# EAGLE design STM Board (EAGLE 9.6.1)
DRAWNBY: Joshua Castle; PROJECT: STM Microcontroller; TITLE: Microcontroller Breakout

## Sheet 1 of 6: Battery Reverse Protection and Power Filtering
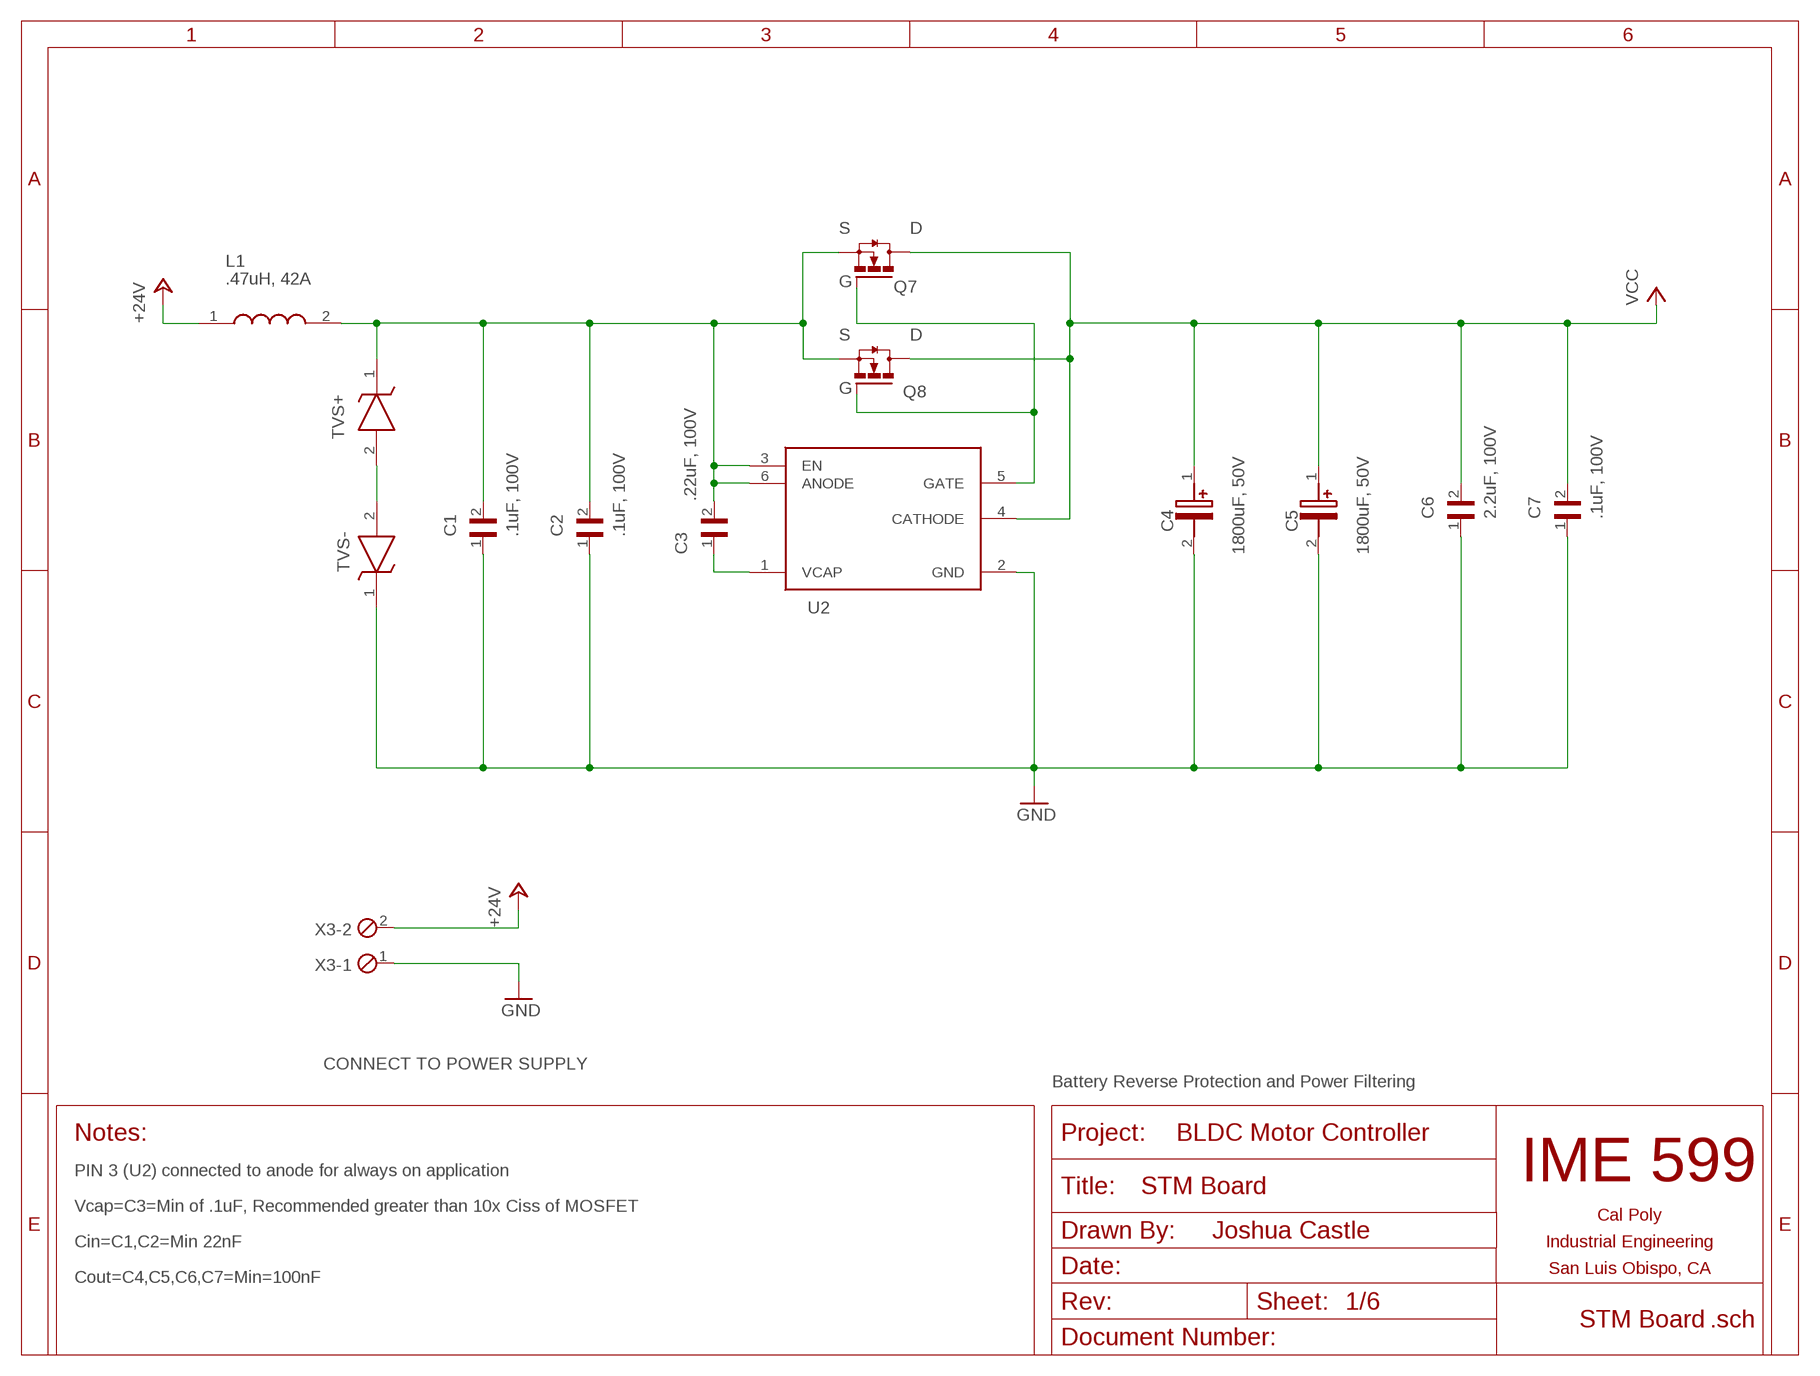
[diagram p0: schematic, sheet 1]
FRAME2 (TITLEBLOCK_LET_L): AUTHOR: Joshua Castle; BOARD_NAME: STM Board; PROJECT_NAME: BLDC Motor Controller

### Parts
C1  .1uF, 100V  CGA4J2X7R1E474K125AA  [CAPC2012X145N]
C2  .1uF, 100V  CGA4J2X7R1E474K125AA  [CAPC2012X145N]
C3  .22uF, 100V  C0805C224K1RECAUTO  [CAPC2012X140N]
C4  1800uF, 50V  EGPA500ELL182MU40S(HORIZONTAL)  [CAPPRD750W80D1475H4150(HORIZONTAL)]
C5  1800uF, 50V  EGPA500ELL182MU40S(HORIZONTAL)  [CAPPRD750W80D1475H4150(HORIZONTAL)]
C6  2.2uF, 100V  C1210X225K1RACAUTO  [CAPC3326X230N]
C7  .1uF, 100V  CGA4J2X7R2A104K125AA  [CAPC2012X145N]
L1  .47uH, 42A  HCM1A1305V2-R47-R  [HCM1A1305V2R47R]
Q7  FDBL86361-F085  [H-PSOF8L-11.68X9.80_1]
Q8  FDBL86361-F085  [H-PSOF8L-11.68X9.80_1]
TVS+  SMBJ58A-Q  [DIOM5436X244N]
TVS-  SMBJ26A-Q  [DIOM5436X244N]
U2  LM74700-Q1MKX-1_NOPB  [SOT95P280X145-6N]
X3  SCREWTERM_2P_254  [2POL254]

### Nets
+24V: L1.1 X3.2
GND: C1.1 C2.1 C4.2(-) C5.2(-) C6.1 C7.1 TVS-.1(K) U2.2(GND) X3.1 ; also sheet 2,3,5,6
N$14: Q7.1(G) Q8.1(G) U2.5(GATE)
N$16: C3.1 U2.1(VCAP)
PN$6: C1.2 C2.2 C3.2 L1.2 Q7.2(S) Q7.3(S) Q7.4(S) Q7.5(S) Q7.6(S) Q7.7(S) Q7.8(S) Q8.2(S) Q8.3(S) Q8.4(S) Q8.5(S) Q8.6(S) Q8.7(S) Q8.8(S) TVS+.1(K) U2.3(EN) U2.6(ANODE)
PN$25: TVS+.2(A) TVS-.2(A)
VCC: C4.1(+) C5.1(+) C6.2 C7.2 Q7.9(D) Q7.10(D) Q7.11(D) Q7.12(D) Q7.13(D) Q8.9(D) Q8.10(D) Q8.11(D) Q8.12(D) Q8.13(D) U2.4(CATHODE) ; also sheet 2,3,4

### Notes on the sheet
- S | D
- G
- S | D
- G
- CONNECT TO POWER SUPPLY
- Battery Reverse Protection and Power Filtering
- PIN 3 (U2) connected to anode for always on application
- Vcap=C3=Min of .1uF, Recommended greater than 10x Ciss of MOSFET
- Cin=C1,C2=Min 22nF
- Cout=C4,C5,C6,C7=Min=100nF

## Sheet 2 of 6: 3-Phase Bridge (Motor Driver Side)
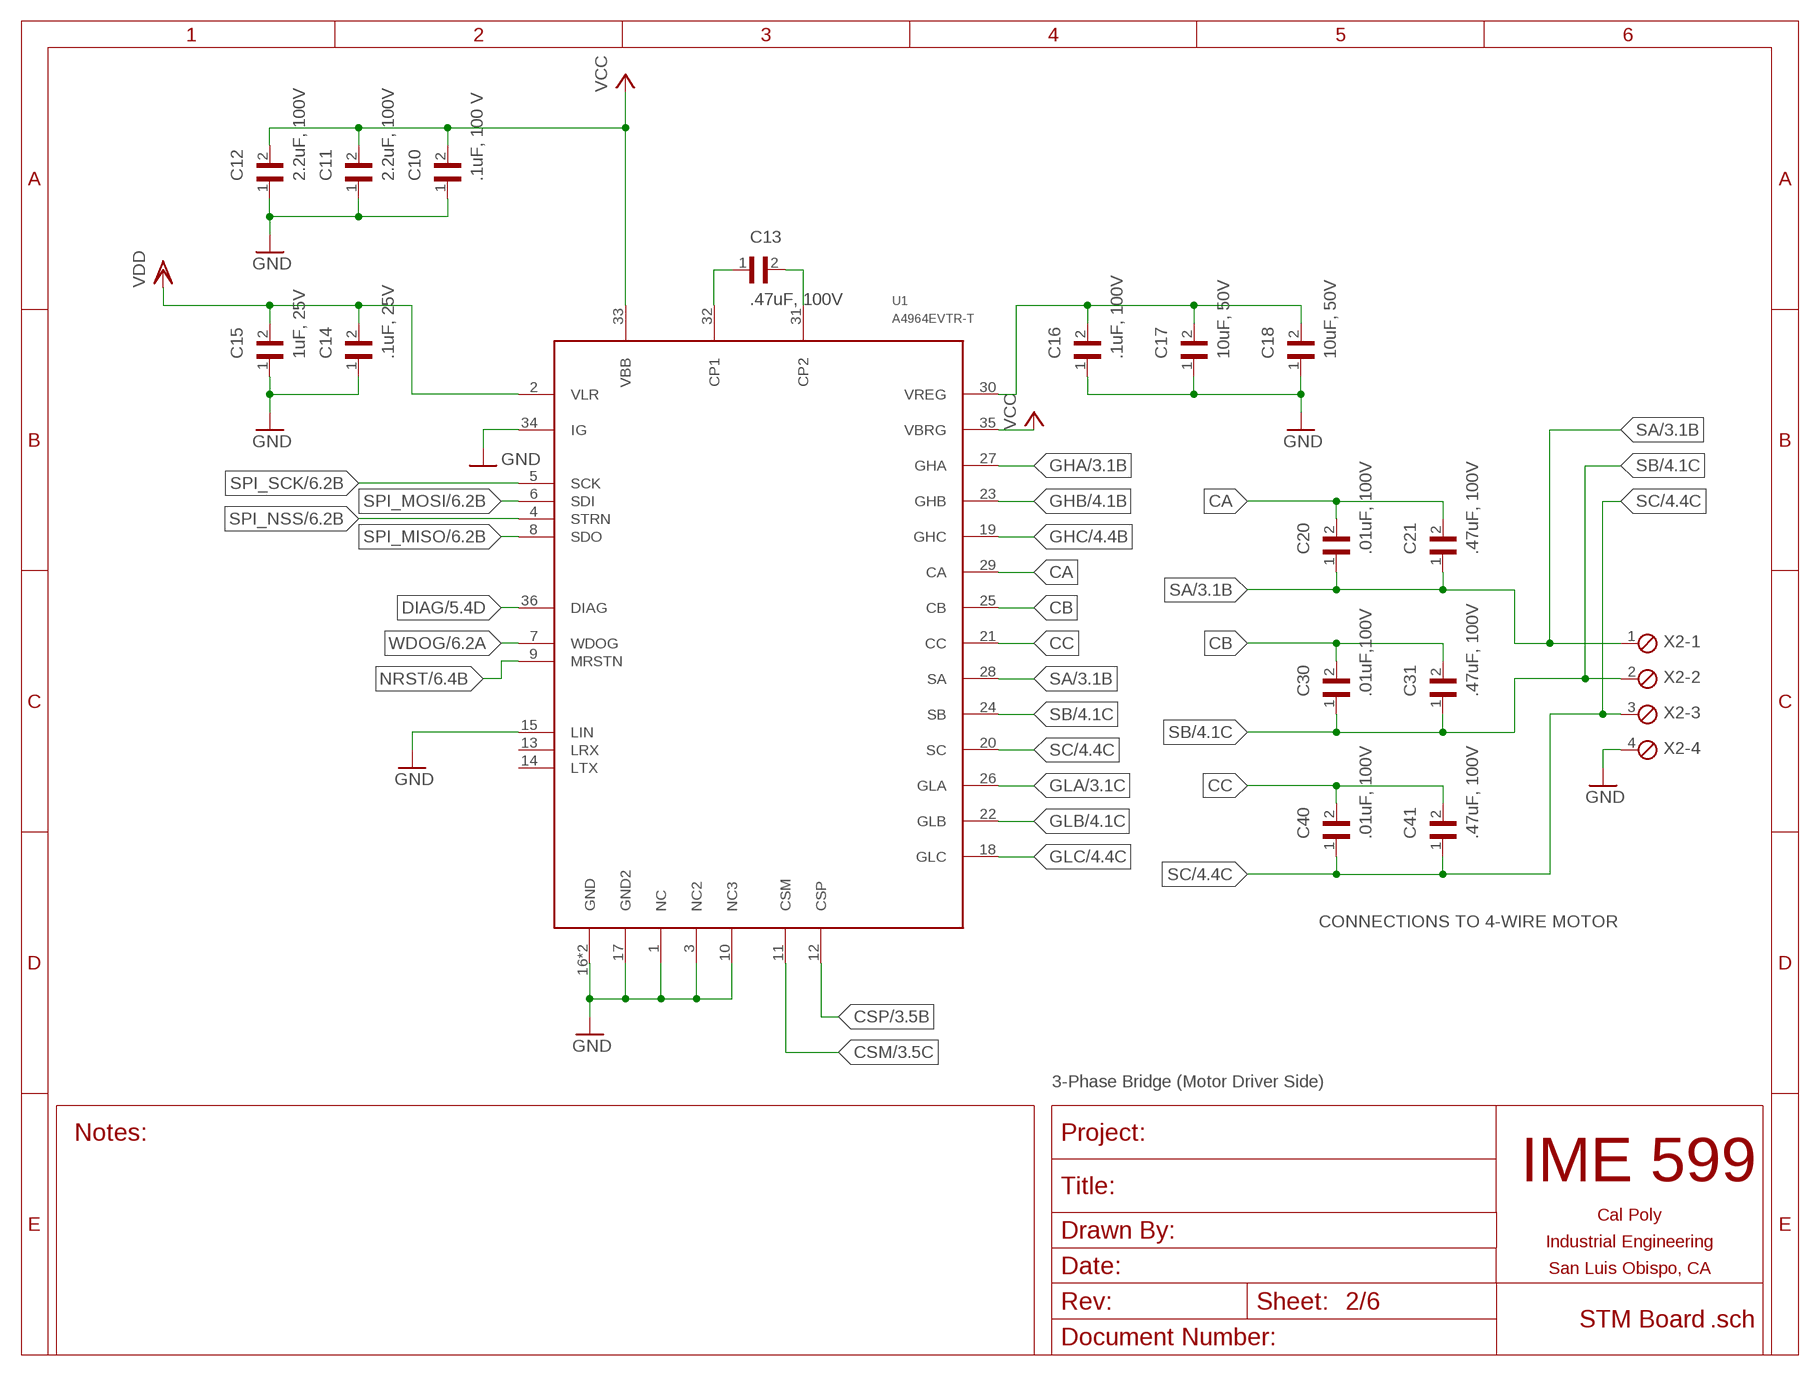
[diagram p1: schematic, sheet 2]

### Parts
C10  .1uF, 100 V  CGA4J2X7R2A104K125AA  [CAPC2012X145N]
C11  2.2uF, 100V  C1210X225K1RACAUTO  [CAPC3326X230N]
C12  2.2uF, 100V  C1210X225K1RACAUTO  [CAPC3326X230N]
C13  .47uF, 100V  08051C474K4T2A  [CAPC2012X140N]
C14  .1uF, 25V  CGA3E2X7R1E104K080AA  [CAPC1608X90N]
C15  1uF, 25V  GCM21BR71H105KA03K  [CAPC2012X140N]
C16  .1uF, 100V  CGA4J2X7R1E474K125AA  [CAPC2012X145N]
C17  10uF, 50V  UMJ325KB7106KMHP  [CAPC3225X280N]
C18  10uF, 50V  UMJ325KB7106KMHP  [CAPC3225X280N]
C20  .01uF, 100V  GCM188R72A103KA37D  [CAPC1608X90N]
C21  .47uF, 100V  08051C474K4T2A  [CAPC2012X140N]
C30  .01uF,100V  GCM188R72A103KA37D  [CAPC1608X90N]
C31  .47uF, 100V  08051C474K4T2A  [CAPC2012X140N]
C40  .01uF, 100V  GCM188R72A103KA37D  [CAPC1608X90N]
C41  .47uF, 100V  08051C474K4T2A  [CAPC2012X140N]
U1  A4964EVTR-T  [A4964EVTR-T]
X2  SCREWTERM_4P_254  [4POL254]

### Nets
CA: C20.2 C21.2 U1.29(CA)
CB: C30.2 C31.2 U1.25(CB)
CC: C40.2 C41.2 U1.21(CC)
CSM: U1.11(CSM) ; also sheet 3
CSP: U1.12(CSP) ; also sheet 3
DIAG: U1.36(DIAG) ; also sheet 5
GHA: U1.27(GHA) ; also sheet 3
GHB: U1.23(GHB) ; also sheet 4
GHC: U1.19(GHC) ; also sheet 4
GLA: U1.26(GLA) ; also sheet 3
GLB: U1.22(GLB) ; also sheet 4
GLC: U1.18(GLC) ; also sheet 4
GND: C10.1 C11.1 C12.1 C14.1 C15.1 C16.1 C17.1 C18.1 U1.1(NC) U1.3(NC2) U1.10(NC3) U1.15(LIN) U1.16(GND) U1.17(GND2) U1.34(IG) U1.37(GND) X2.4 ; also sheet 1,3,5,6
N$2: C13.1 U1.32(CP1)
N$8: C13.2 U1.31(CP2)
NRST: U1.9(MRSTN) ; also sheet 6
SA: C20.1 C21.1 U1.28(SA) X2.1 ; also sheet 3
SB: C30.1 C31.1 U1.24(SB) X2.2 ; also sheet 4
SC: C40.1 C41.1 U1.20(SC) X2.3 ; also sheet 4
SPI_MISO: U1.8(SDO) ; also sheet 6
SPI_MOSI: U1.6(SDI) ; also sheet 6
SPI_NSS: U1.4(STRN) ; also sheet 6
SPI_SCK: U1.5(SCK) ; also sheet 6
VCC: C10.2 C11.2 C12.2 U1.33(VBB) U1.35(VBRG) ; also sheet 1,3,4
VDD: C14.2 C15.2 U1.2(VLR) ; also sheet 5,6
VREG: C16.2 C17.2 C18.2 U1.30(VREG)
WDOG: U1.7(WDOG) ; also sheet 6
Unconnected: U1.13(LRX) U1.14(LTX)

### Notes on the sheet
- CONNECTIONS TO 4-WIRE MOTOR
- 3-Phase Bridge (Motor Driver Side)

## Sheet 3 of 6: 3-Phase Bridge (MOSFETs) (Phase A)
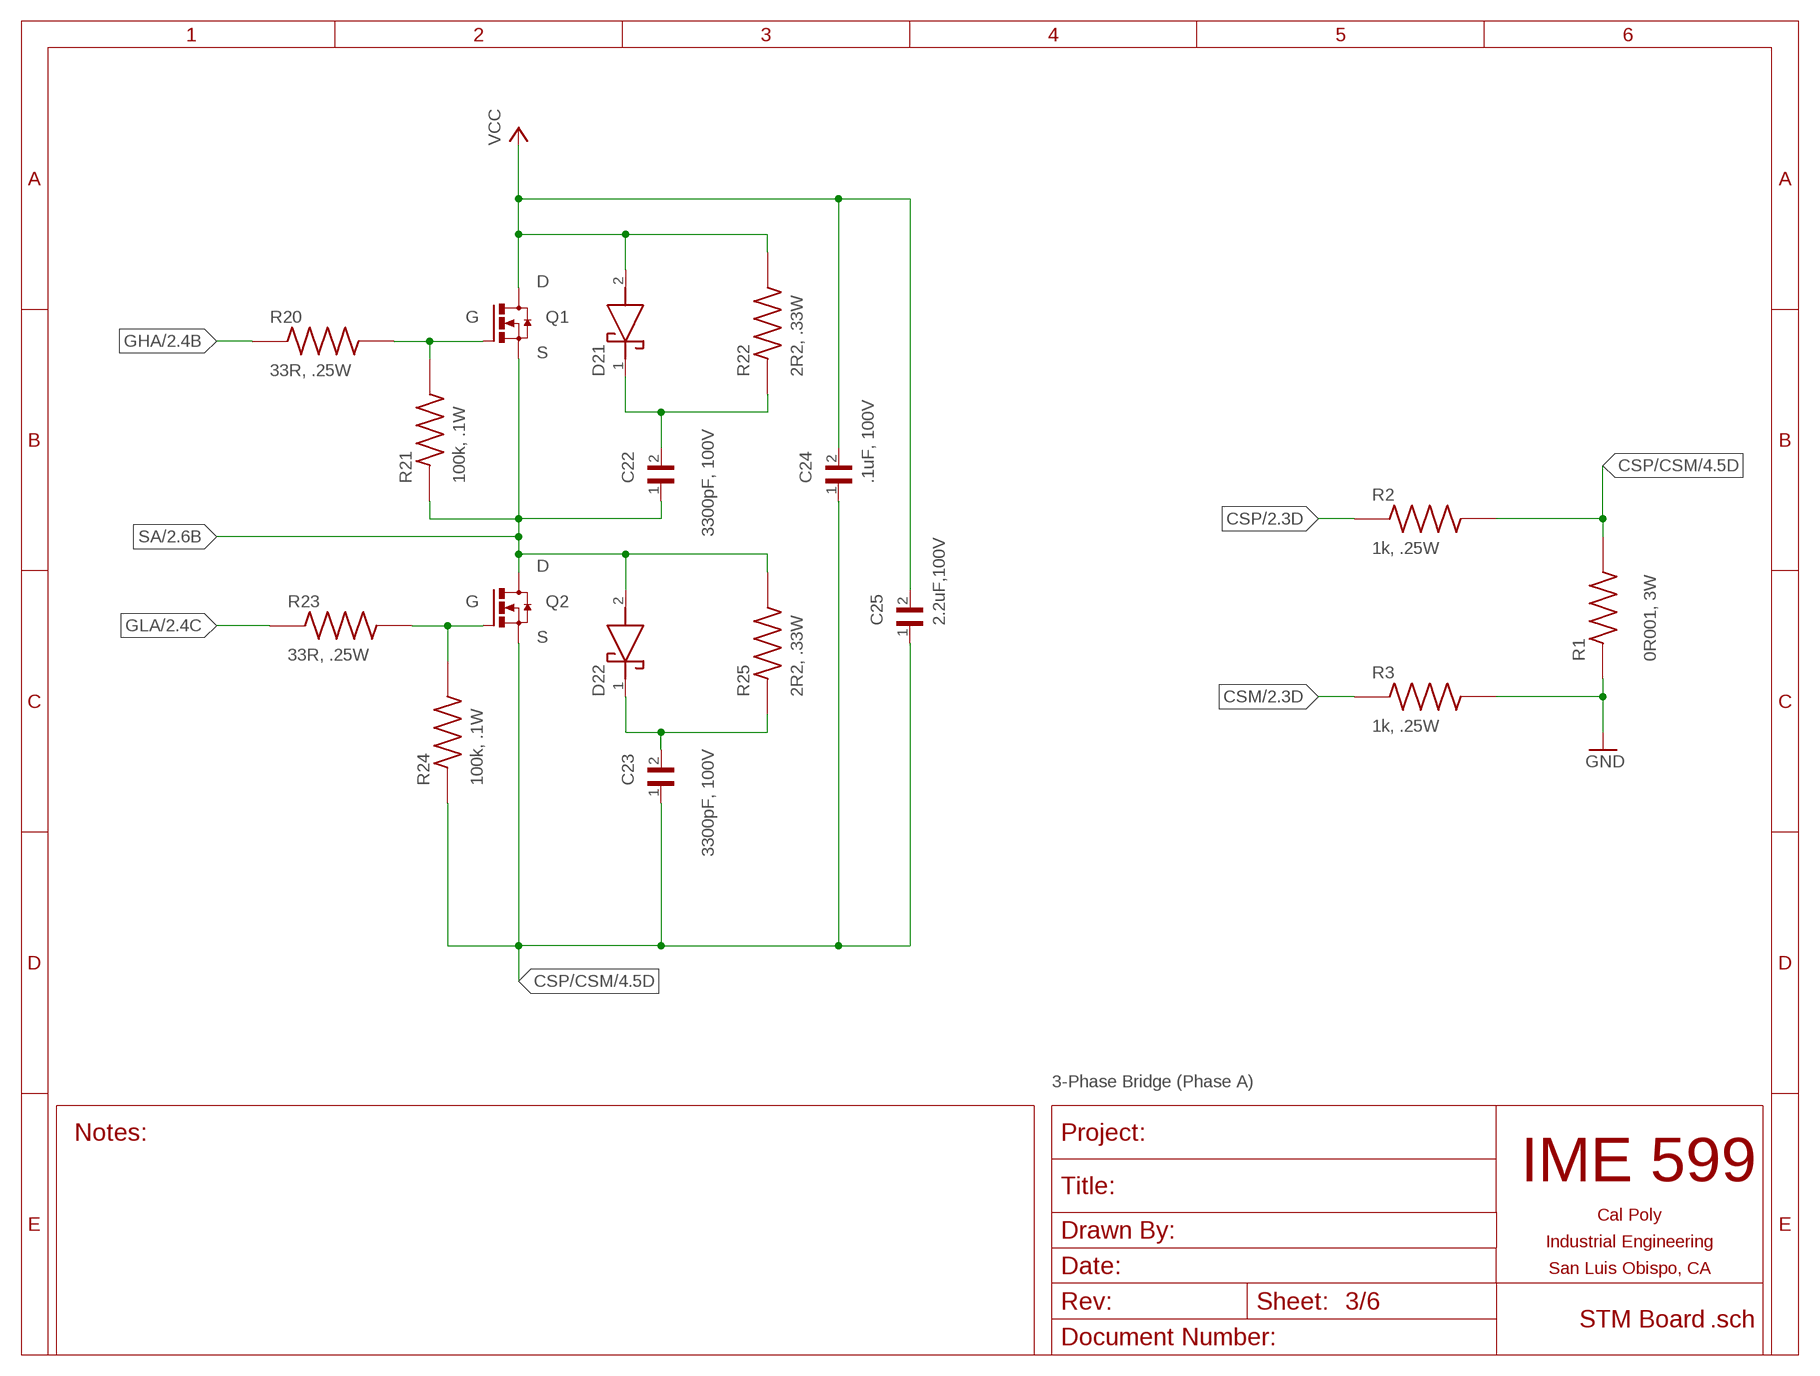
[diagram p2: schematic, sheet 3]

### Parts
C22  3300pF, 100V  GCM188R72A332KA37D  [CAPC1608X90N]
C23  3300pF, 100V  GCM188R72A332KA37D  [CAPC1608X90N]
C24  .1uF, 100V  CGA4J2X7R1E474K125AA  [CAPC2012X145N]
C25  2.2uF,100V  C1210X225K1RACAUTO  [CAPC3326X230N]
D21  PMEG6010EP,115  [SODFL4725X110N]
D22  PMEG6010EP,115  [SODFL4725X110N]
Q1  NVMFS5C604NLAFT1G  [DFN5_5X6(SO-8FL)_CASE-488AA_IS]
Q2  NVMFS5C604NLAFT1G  [DFN5_5X6(SO-8FL)_CASE-488AA_IS]
R1  0R001, 3W  CRA2512-FZ-R100ELF  [RESC6432X90N]
R2  1k, .25W  ESR03EZPF1001  [RESC1608X55N]
R3  1k, .25W  ESR03EZPF1001  [RESC1608X55N]
R20  33R, .25W  CRCW060333R0FKEAHP  [0805RES]
R21  100k, .1W  CRCW06031K00FKEA  [RESC1508X50N]
R22  2R2, .33W  SG73P1JTTD2R20F  [RESC1608X55N]
R23  33R, .25W  CRCW060333R0FKEAHP  [0805RES]
R24  100k, .1W  CRCW06031K00FKEA  [RESC1508X50N]
R25  2R2, .33W  SG73P1JTTD2R20F  [RESC1608X55N]

### Nets
CSM: R3.1 ; also sheet 2
CSP: R2.1 ; also sheet 2
CSP/CSM: C23.1 C24.1 C25.1 Q2.1(S) Q2.2(S) Q2.3(S) R1.2 R2.2 R24.1 ; also sheet 4
GHA: R20.1 ; also sheet 2
GLA: R23.1 ; also sheet 2
GND: R1.1 R3.2 ; also sheet 1,2,5,6
N$11: Q1.4(G) R20.2 R21.2
N$19: Q2.4(G) R23.2 R24.2
PN$15: C22.2 D21.1(K) R22.1
PN$20: C23.2 D22.1(K) R25.1
SA: C22.1 D22.2(A) Q1.1(S) Q1.2(S) Q1.3(S) Q2.5(D) Q2.6(D) Q2.7(D) R21.1 R25.2 ; also sheet 2
VCC: C24.2 C25.2 D21.2(A) Q1.5(D) Q1.6(D) Q1.7(D) R22.2 ; also sheet 1,2,4

### Notes on the sheet
- D
- G
- S
- D
- G
- S
- 3-Phase Bridge (Phase A)

## Sheet 4 of 6: 3-Phase Bridge (MOSFETs) (Phases B & C)
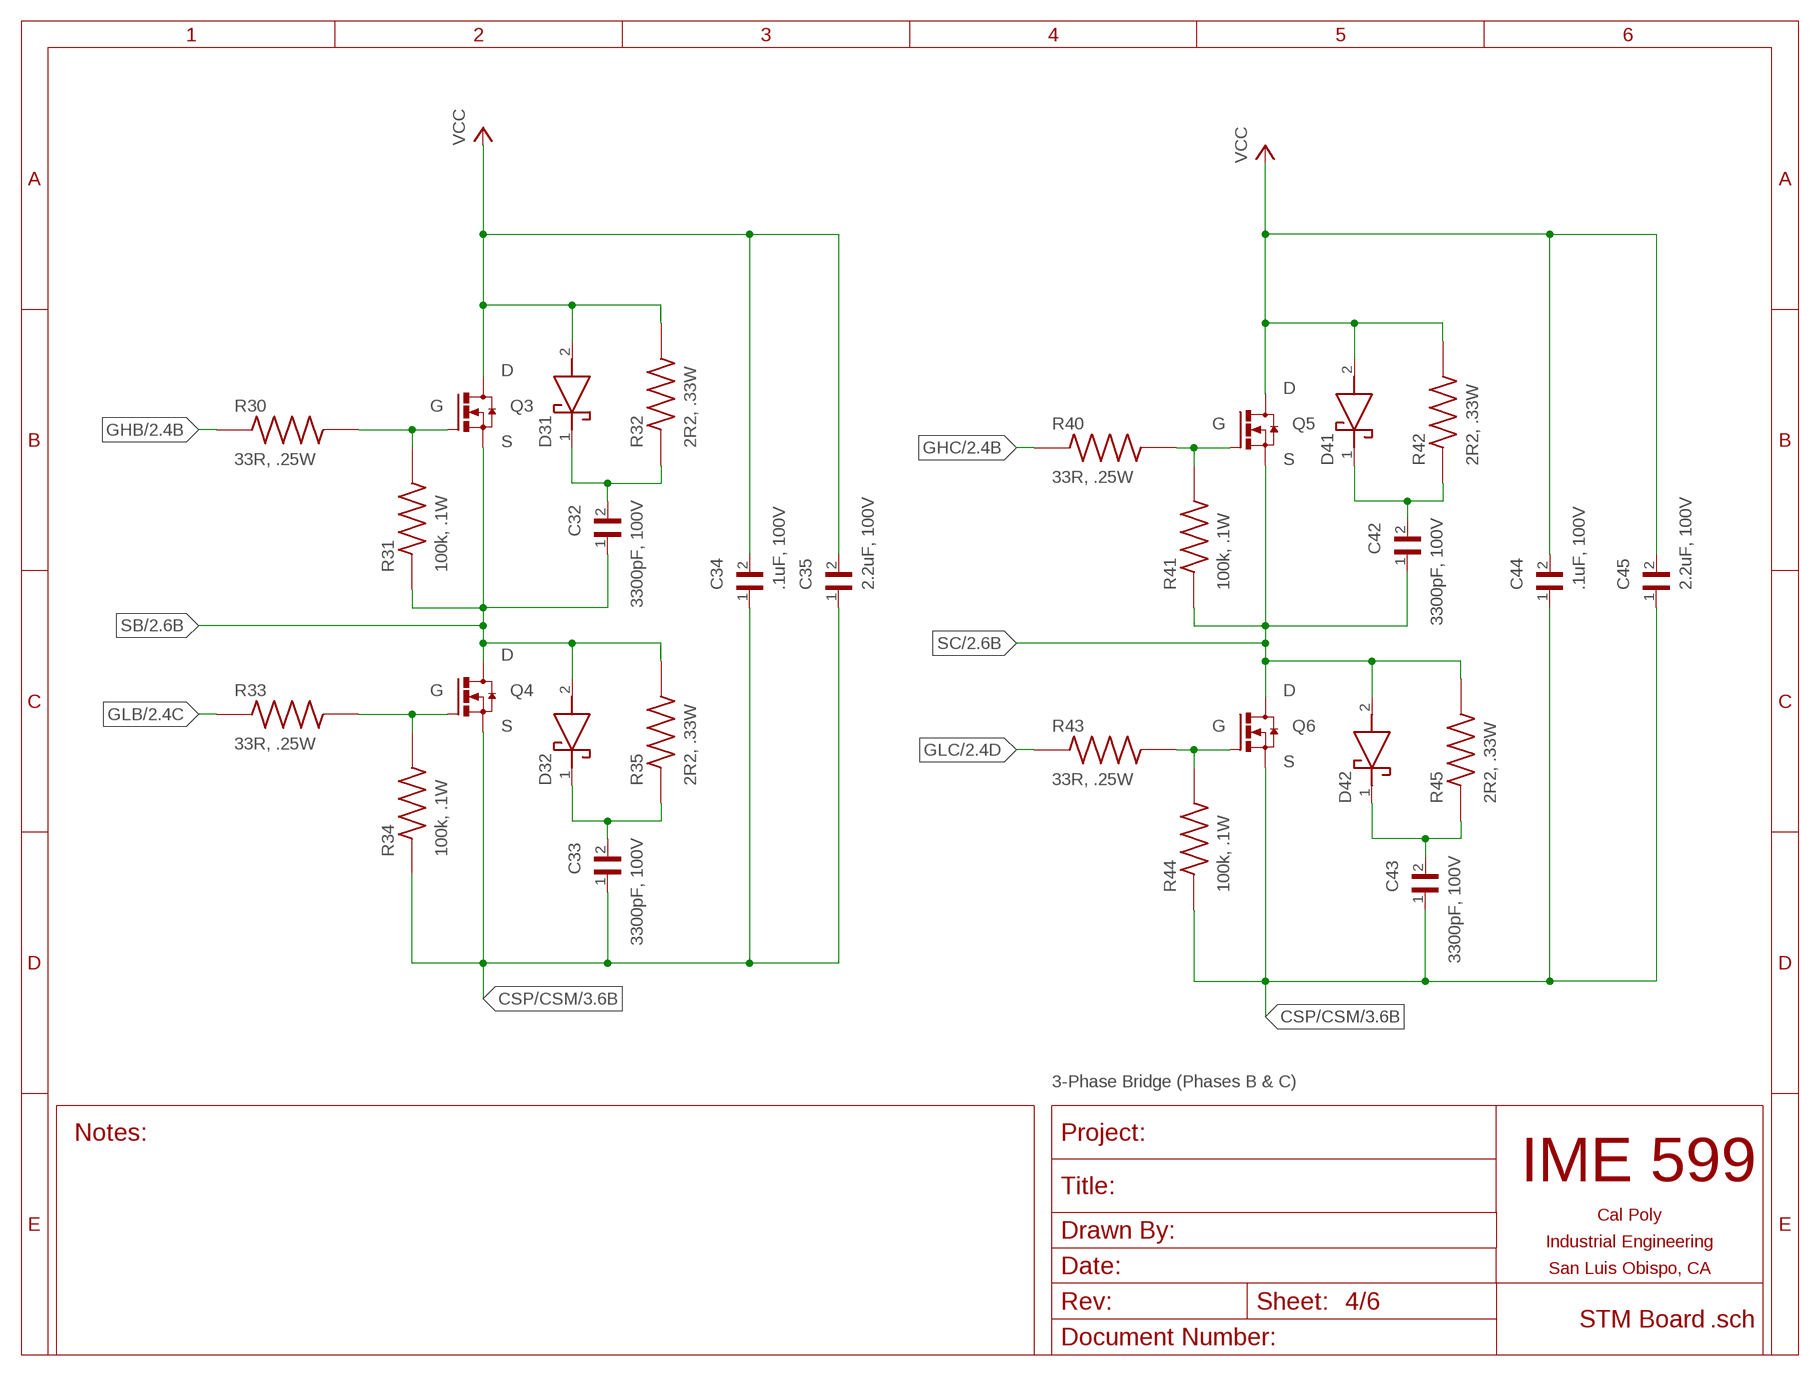
[diagram p3: schematic, sheet 4]

### Parts
C32  3300pF, 100V  GCM188R72A332KA37D  [CAPC1608X90N]
C33  3300pF, 100V  GCM188R72A332KA37D  [CAPC1608X90N]
C34  .1uF, 100V  CGA4J2X7R2A104K125AA  [CAPC2012X145N]
C35  2.2uF, 100V  C1210X225K1RACAUTO  [CAPC3326X230N]
C42  3300pF, 100V  GCM188R72A332KA37D  [CAPC1608X90N]
C43  3300pF, 100V  GCM188R72A332KA37D  [CAPC1608X90N]
C44  .1uF, 100V  CGA4J2X7R2A104K125AA  [CAPC2012X145N]
C45  2.2uF, 100V  C1210X225K1RACAUTO  [CAPC3326X230N]
D31  PMEG6010EP,115  [SODFL4725X110N]
D32  PMEG6010EP,115  [SODFL4725X110N]
D41  PMEG6010EP,115  [SODFL4725X110N]
D42  PMEG6010EP,115  [SODFL4725X110N]
Q3  NVMFS5C604NLAFT1G  [DFN5_5X6(SO-8FL)_CASE-488AA_IS]
Q4  NVMFS5C604NLAFT1G  [DFN5_5X6(SO-8FL)_CASE-488AA_IS]
Q5  NVMFS5C604NLAFT1G  [DFN5_5X6(SO-8FL)_CASE-488AA_IS]
Q6  NVMFS5C604NLAFT1G  [DFN5_5X6(SO-8FL)_CASE-488AA_IS]
R30  33R, .25W  CRCW060333R0FKEAHP  [0805RES]
R31  100k, .1W  CRCW0603100KFKEA  [RESC1608X55N]
R32  2R2, .33W  SG73P1JTTD2R20F  [RESC1608X55N]
R33  33R, .25W  CRCW060333R0FKEAHP  [0805RES]
R34  100k, .1W  CRCW0603100KFKEA  [RESC1608X55N]
R35  2R2, .33W  SG73P1JTTD2R20F  [RESC1608X55N]
R40  33R, .25W  CRCW060333R0FKEAHP  [0805RES]
R41  100k, .1W  CRCW0603100KFKEA  [RESC1608X55N]
R42  2R2, .33W  SG73P1JTTD2R20F  [RESC1608X55N]
R43  33R, .25W  CRCW060333R0FKEAHP  [0805RES]
R44  100k, .1W  CRCW0603100KFKEA  [RESC1608X55N]
R45  2R2, .33W  SG73P1JTTD2R20F  [RESC1608X55N]

### Nets
CSP/CSM: C33.1 C34.1 C35.1 C43.1 C44.1 C45.1 Q4.1(S) Q4.2(S) Q4.3(S) Q6.1(S) Q6.2(S) Q6.3(S) R34.1 R44.1 ; also sheet 3
GHB: R30.1 ; also sheet 2
GHC: R40.1 ; also sheet 2
GLB: R33.1 ; also sheet 2
GLC: R43.1 ; also sheet 2
N$10: Q3.4(G) R30.2 R31.2
N$17: Q6.4(G) R43.2 R44.2
N$18: Q4.4(G) R33.2 R34.2
N$24: Q5.4(G) R40.2 R41.2
PN$28: C32.2 D31.1(K) R32.1
PN$29: C33.2 D32.1(K) R35.1
PN$33: C43.2 D42.1(K) R45.1
PN$34: C42.2 D41.1(K) R42.1
SB: C32.1 D32.2(A) Q3.1(S) Q3.2(S) Q3.3(S) Q4.5(D) Q4.6(D) Q4.7(D) R31.1 R35.2 ; also sheet 2
SC: C42.1 D42.2(A) Q5.1(S) Q5.2(S) Q5.3(S) Q6.5(D) Q6.6(D) Q6.7(D) R41.1 R45.2 ; also sheet 2
VCC: C34.2 C35.2 C44.2 C45.2 D31.2(A) D41.2(A) Q3.5(D) Q3.6(D) Q3.7(D) Q5.5(D) Q5.6(D) Q5.7(D) R32.2 R42.2 ; also sheet 1,2,3

### Notes on the sheet
- D
- D
- G
- G
- S
- S
- D
- G | D
- S | G
- S
- 3-Phase Bridge (Phases B & C)

## Sheet 5 of 6: Speed Control and Diagnostic
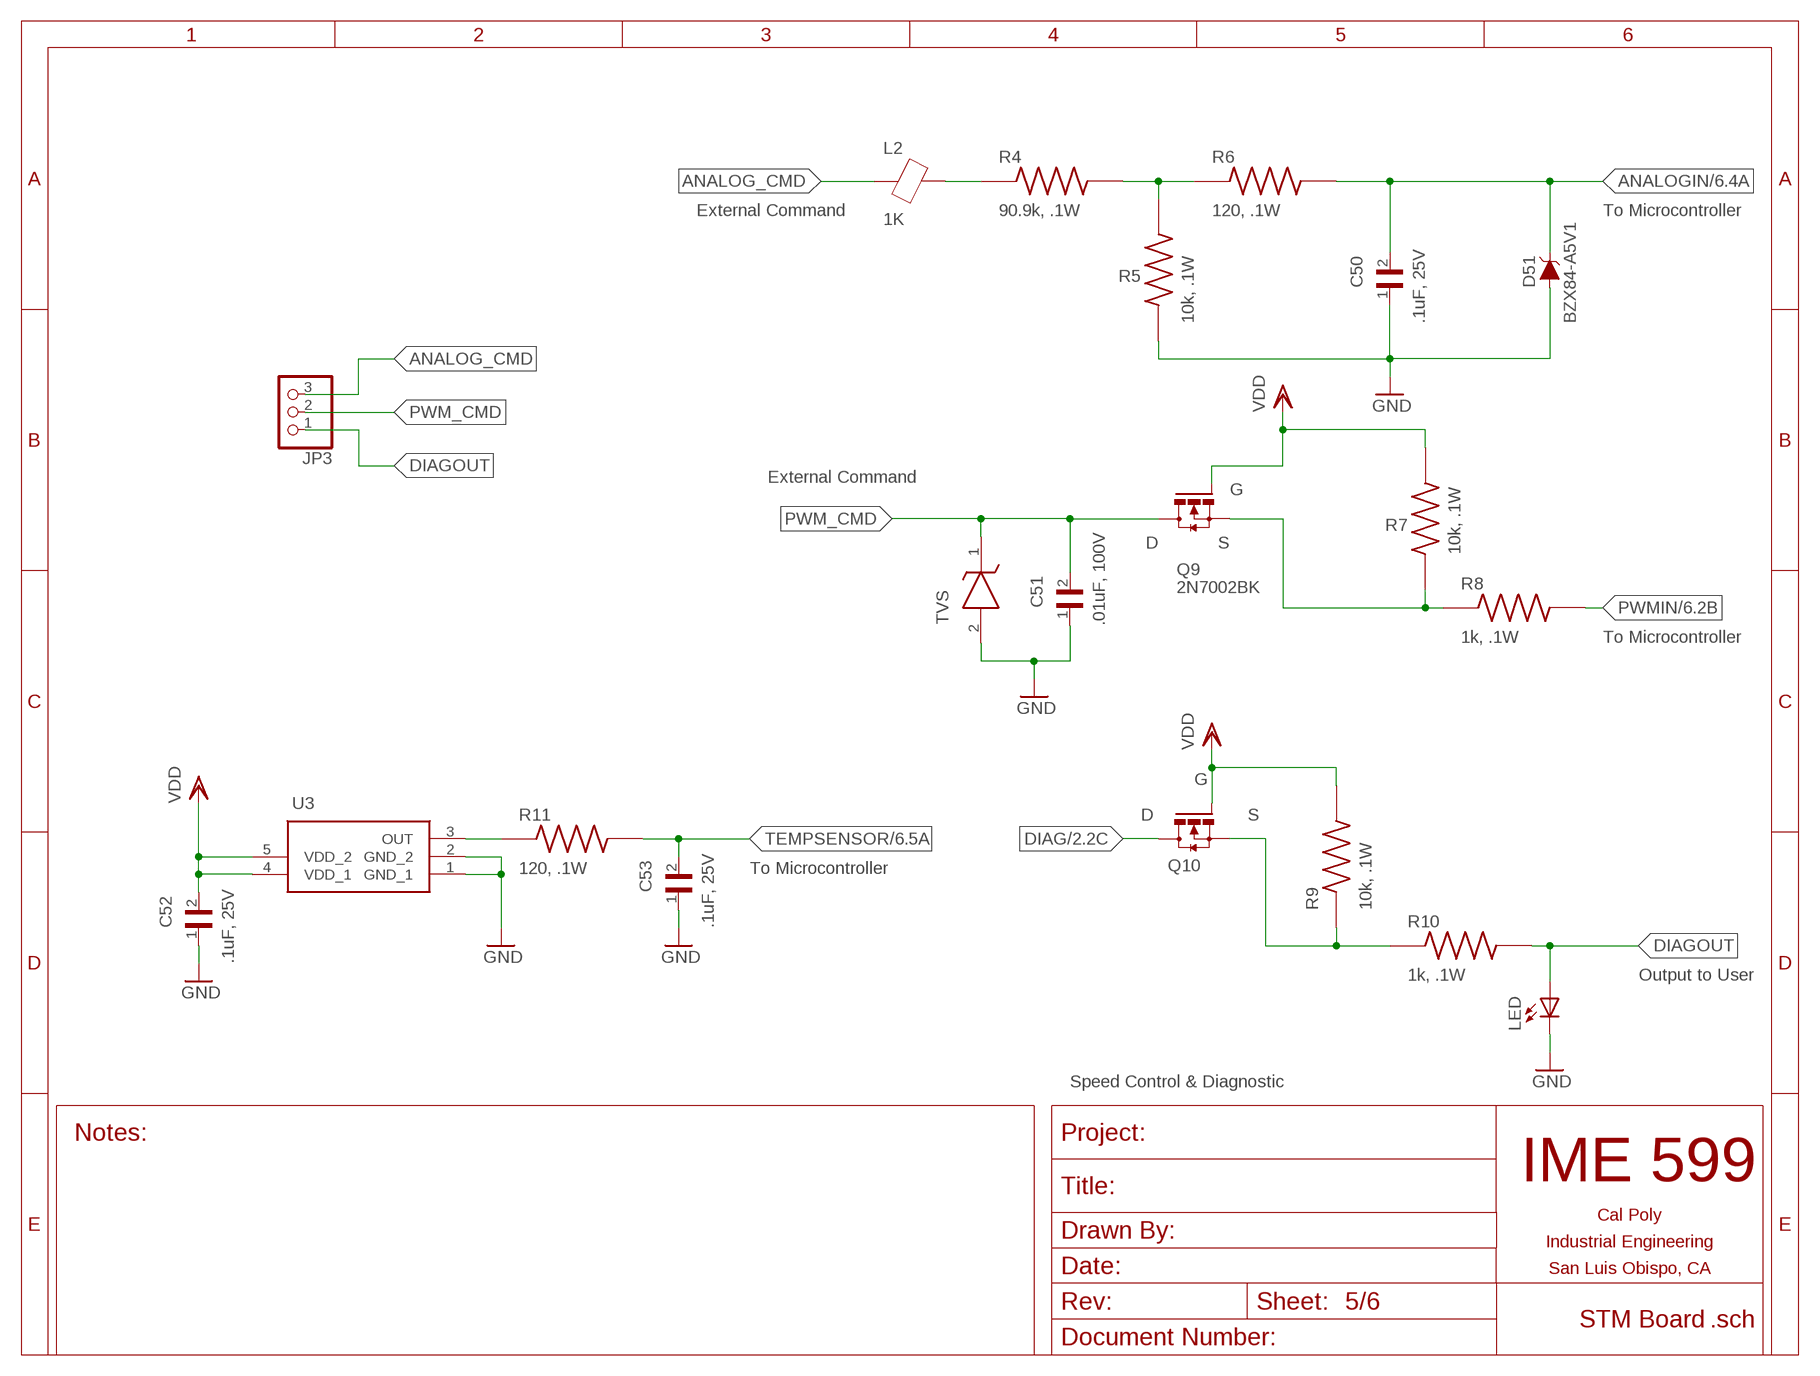
[diagram p4: schematic, sheet 5]

### Parts
C50  .1uF, 25V  CGA3E2X7R1E104K080AA  [CAPC1608X90N]
C51  .01uF, 100V  GCM188R72A223KA37J  [CAPC1608X90N]
C52  .1uF, 25V  CGA3E2X7R1E104K080AA  [CAPC1608X90N]
C53  .1uF, 25V  CGA3E2X7R1E104K080AA  [CAPC1608X90N]
D51  BZX84-A5V1  BZX84-A5V1,215  [SOT95P230X110-3N]
JP3  PINHD-1X3  [1X03]
L2  1K  KMZ1608RHR102ATD25  [BEADC1608X95N]
LED  LTST-C170KRKT  [DIOC200X125X110]
Q9  2N7002BK  2N002BK  [2N7002BK]
Q10  BSS123N_H6327  [BSS123N_H6327]
R4  90.9k, .1W  CRCW060318K0FK  [CAPC1608X90N]
R5  10k, .1W  CRCW060322K0FK  [CAPC1608X90N]
R6  120, .1W  CRCW0603120RFK  [CAPC1608X90N]
R7  10k, .1W  CRCW060310K0FKEB  [RESC1508X50N]
R8  1k, .1W  CRCW06031K00FKEA  [RESC1508X50N]
R9  10k, .1W  CRCW060310K0FKEB  [RESC1508X50N]
R10  1k, .1W  CRCW06031K00FKEA  [RESC1508X50N]
R11  120, .1W  CRCW0603120RFK  [CAPC1608X90N]
TVS  SMBJ30AQ-13-F  [DIOM5336X250N]
U3  LMT86QDCKRQ1  [SOT65P210X110-5N]

### Nets
ANALOG_CMD: JP3.3 L2.1
ANALOGIN: C50.2 D51.3(C) R6.2 ; also sheet 6
DIAG: Q10.3(D) ; also sheet 2
DIAGOUT: JP3.1 LED.+ R10.2
GND: C50.1 C51.1 C52.1 C53.1 D51.1(A) D51.2(A) LED.- R5.1 TVS.2(A) U3.1(GND_1) U3.2(GND_2) ; also sheet 1,2,3,6
N$1: R11.1 U3.3(OUT)
N$3: R4.2 R5.2 R6.1
N$4: Q9.2(S) R7.1 R8.1
N$5: L2.2 R4.1
N$7: Q10.2(S) R9.1 R10.1
PWM_CMD: C51.2 JP3.2 Q9.3(D) TVS.1(K)
PWMIN: R8.2 ; also sheet 6
TEMPSENSOR: C53.2 R11.2 ; also sheet 6
VDD: C52.2 Q9.1(G) Q10.1(G) R7.2 R9.2 U3.4(VDD_1) U3.5(VDD_2) ; also sheet 2,6

### Notes on the sheet
- External Command | To Microcontroller
- External Command | G
- D | S
- To Microcontroller
- G
- D | S
- To Microcontroller
- Output to User
- Speed Control & Diagnostic

## Sheet 6 of 6: Microcontroller
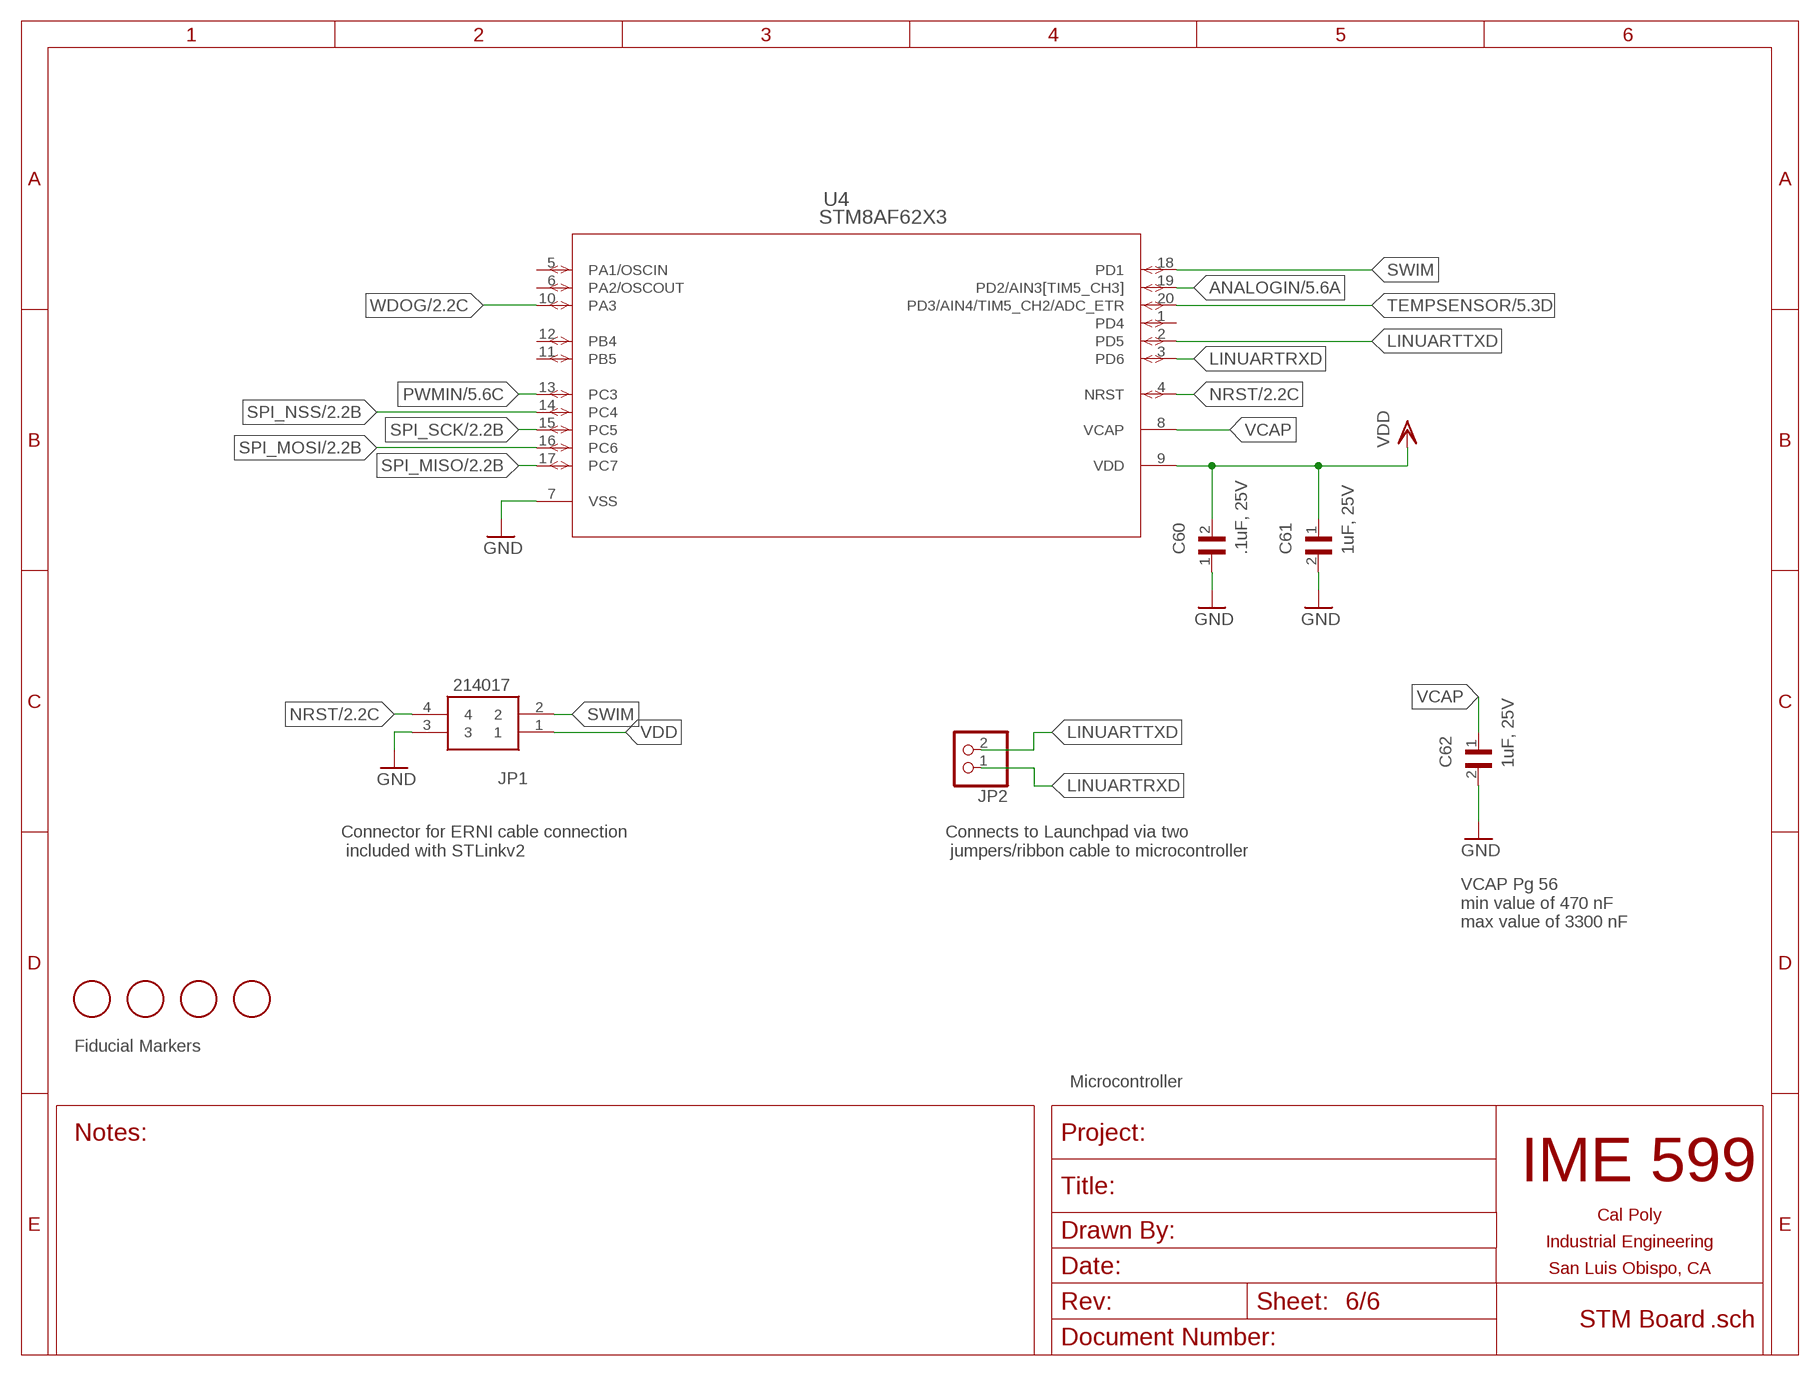
[diagram p5: schematic, sheet 6]

### Parts
C60  .1uF, 25V  CGA3E2X7R1E104K080AA  [CAPC1608X90N]
C61  1uF, 25V  C0805C105K3RACAUTO  [CAPC2012X88N]
C62  1uF, 25V  C0805C105K3RACAUTO  [CAPC2012X88N]
JP1  214017  [214017]
JP2  PINHD-1X2  [1X02]
U4  STM8AF62X3  [TSSOP20]
U$1  FIDUCIAL  [FIDUCIAL_1MM]
U$2  FIDUCIAL  [FIDUCIAL_1MM]
U$3  FIDUCIAL  [FIDUCIAL_1MM]
U$4  FIDUCIAL  [FIDUCIAL_1MM]

### Nets
ANALOGIN: U4.19(PD2/AIN3[TIM5_CH3]) ; also sheet 5
GND: C60.1 C61.2 C62.2 JP1.3 U4.7(VSS) ; also sheet 1,2,3,5
LINUARTRXD: JP2.1 U4.3(PD6)
LINUARTTXD: JP2.2 U4.2(PD5)
NRST: JP1.4 U4.4(NRST) ; also sheet 2
PWMIN: U4.13(PC3) ; also sheet 5
SPI_MISO: U4.17(PC7) ; also sheet 2
SPI_MOSI: U4.16(PC6) ; also sheet 2
SPI_NSS: U4.14(PC4) ; also sheet 2
SPI_SCK: U4.15(PC5) ; also sheet 2
SWIM: JP1.2 U4.18(PD1)
TEMPSENSOR: U4.20(PD3/AIN4/TIM5_CH2/ADC_ETR) ; also sheet 5
VCAP: C62.1 U4.8(VCAP)
VDD: C60.2 C61.1 JP1.1 U4.9(VDD) ; also sheet 2,5
WDOG: U4.10(PA3) ; also sheet 2
Unconnected: U4.1(PD4) U4.5(PA1/OSCIN) U4.6(PA2/OSCOUT) U4.11(PB5) U4.12(PB4)

### Notes on the sheet
- Connector for ERNI cable connection
   included with STLinkv2
- Connects to Launchpad via two
   jumpers/ribbon cable to microcontroller
- VCAP Pg 56
  min value of 470 nF
  max value of 3300 nF
- Fiducial Markers
- Microcontroller

## Library data of the parts
C1 C2 C16 C24 = BLDC:CGA4J2X7R1E474K125AA: CAP, MLCC, AEC-Q200, X7R, 0.47UF, 0805; AVAILABILITY: Unavailable; DESCRIPTION: CGA Series 0805 470 nF 25 V ±10 % Tolerance X7R SMT Multilayer Ceramic Capacitor; MF: TDK; MP: CGA4J2X7R1E474K125AA; PACKAGE: 2012 TDK; PRICE: None
C3 = BLDCBOMv3:C0805C224K1RECAUTO; DESCRIPTION: 0.22µF ±10% 100V Ceramic Capacitor X7R 0805 _2012 Metric_; DIGI-KEY_PART_NUMBER: 399-17890-1-ND; DIGI-KEY_PURCHASE_URL: https://www.digikey.com/product-detail/en/kemet/C0805C224K1RECAUTO/399-17890-1-ND/8640557?utm_source=snapeda&utm_medium=aggregator&utm_campaign=symbol; MF: KEMET; MP: C0805C224K1RECAUTO; PACKAGE: 2012 KEMET
C4 C5 = BLDCBOMv3:EGPA500ELL182MU40S(HORIZONTAL)
C6 = BLDCBOMv3:C1210X225K1RACAUTO: 2.2UF 100V 10% 1210; DESCRIPTION: 2.2µF ±10% 100V Ceramic Capacitor X7R 1210 _3225 Metric_; DIGI-KEY_PART_NUMBER: 399-13378-1-ND; DIGI-KEY_PURCHASE_URL: https://www.digikey.com/product-detail/en/kemet/C1210X225K1RACAUTO/399-13378-1-ND/6108932?utm_source=snapeda&utm_medium=aggregator&utm_campaign=symbol; MF: KEMET; MP: C1210X225K1RACAUTO; PACKAGE: 3326 KEMET
C7 C10 C34 C44 = CGA4J2X7R2A104K125AA:CGA4J2X7R2A104K125AA: CAP CER 0.1UF 100V X7R 0805; DESCRIPTION: 0.1µF ±10% 100V Ceramic Capacitor X7R 0805 _2012 Metric_; DIGI-KEY_PART_NUMBER: 445-5827-1-ND; DIGI-KEY_PURCHASE_URL: https://www.digikey.com/product-detail/en/tdk-corporation/CGA4J2X7R2A104K125AA/445-5827-1-ND/2443867?utm_source=snapeda&utm_medium=aggregator&utm_campaign=symbol; MF: TDK; MP: CGA4J2X7R2A104K125AA; PACKAGE: 2012 TDK
C11 C12 C25 C35 C45 = C1210X225K1RACAUTO:C1210X225K1RACAUTO: 2.2UF 100V 10% 1210; DESCRIPTION: 2.2µF ±10% 100V Ceramic Capacitor X7R 1210 _3225 Metric_; DIGI-KEY_PART_NUMBER: 399-13378-1-ND; DIGI-KEY_PURCHASE_URL: https://www.digikey.com/product-detail/en/kemet/C1210X225K1RACAUTO/399-13378-1-ND/6108932?utm_source=snapeda&utm_medium=aggregator&utm_campaign=symbol; MF: KEMET; MP: C1210X225K1RACAUTO; PACKAGE: 3326 KEMET
C13 C21 C31 C41 = 08051C474K4T2A:08051C474K4T2A: Cap Ceramic 0.47uF 100V X7R 10% SMD 0805 125Â°C T/R; DESCRIPTION: 0.47µF ±10% 100V Ceramic Capacitor X7R 0805 _2012 Metric_; DIGI-KEY_PART_NUMBER: 478-10684-1-ND; DIGI-KEY_PURCHASE_URL: https://www.digikey.com/product-detail/en/avx-corporation/08051C474K4T2A/478-10684-1-ND/7536556?utm_source=snapeda&utm_medium=aggregator&utm_campaign=symbol; MF: AVX; MP: 08051C474K4T2A; PACKAGE: 2012 AVX
C14 C50 C52 C53 C60 = CGA3E2X7R1E104K080AA:CGA3E2X7R1E104K080AA: .1UF 25V 10% 0603; DESCRIPTION: 0.1µF ±10% 25V Ceramic Capacitor X7R 0603 _1608 Metric_; DIGI-KEY_PART_NUMBER: 445-5667-1-ND; DIGI-KEY_PURCHASE_URL: https://www.digikey.com/product-detail/en/tdk-corporation/CGA3E2X7R1E104K080AA/445-5667-1-ND/2443707?utm_source=snapeda&utm_medium=aggregator&utm_campaign=symbol; MF: TDK; MP: CGA3E2X7R1E104K080AA; PACKAGE: 1608 TDK
C15 = BLDC:GCM21BR71H105KA03K: Cap Ceramic 1uF 50V X7R 10% Pad SMD 0805 125C Automotive T/R; AVAILABILITY: Unavailable; DESCRIPTION: Cap Ceramic 1uF 50V X7R 10% Pad SMD 0805 125C Automotive T/R; MF: Murata; MP: GCM21BR71H105KA03K; PACKAGE: 2012 Murata; PRICE: None
C17 C18 = UMJ325KB7106KMHP:UMJ325KB7106KMHP: CAP CER 10UF 50V X7R 1210; DESCRIPTION: 10µF ±10% 50V Ceramic Capacitor X7R 1210 _3225 Metric_; DIGI-KEY_PART_NUMBER: 587-6026-1-ND; DIGI-KEY_PURCHASE_URL: https://www.digikey.com/product-detail/en/taiyo-yuden/UMJ325KB7106KMHP/587-6026-1-ND/8040689?utm_source=snapeda&utm_medium=aggregator&utm_campaign=symbol; MF: Taiyo Yuden; MP: UMJ325KB7106KMHP; PACKAGE: 3225 Taiyo Yuden
C20 C30 C40 = GCM188R72A103KA37D:GCM188R72A103KA37D; DESCRIPTION: SMD Capacitor X7R_EIA_ with Capacitance: 10000pF Tol. 10%. Rated Voltage: 100Vdc; DIGI-KEY_PART_NUMBER: 490-4781-1-ND; DIGI-KEY_PURCHASE_URL: https://www.digikey.com/product-detail/en/murata-electronics/GCM188R72A103KA37D/490-4781-1-ND/1641700?utm_source=snapeda&utm_medium=aggregator&utm_campaign=symbol; MF: Murata; MP: GCM188R72A103KA37D; PACKAGE: 1608 Murata
C22 C23 C32 C33 C42 C43 = BLDCBOMv3:GCM188R72A332KA37D: CAP CER 3300PF 100V X7R 0603; DESCRIPTION: SMD Capacitor X7R_EIA_ with Capacitance: 3300pF Tol. 10%. Rated Voltage: 100Vdc; DIGI-KEY_PART_NUMBER: 490-14767-1-ND; DIGI-KEY_PURCHASE_URL: https://www.digikey.com/product-detail/en/murata-electronics/GCM188R72A332KA37D/490-14767-1-ND/6606373?utm_source=snapeda&utm_medium=aggregator&utm_campaign=symbol; MF: Murata; MP: GCM188R72A332KA37D; PACKAGE: 1608 Murata
C51 = BLDC:GCM188R72A223KA37J: Cap Ceramic 0.022uF 100V X7R 10% Pad SMD 0603 125C Automotive T/R; AVAILABILITY: Unavailable; DESCRIPTION: Cap Ceramic 0.022uF 100V X7R 10% Pad SMD 0603 125C Automotive T/R; MF: Murata; MP: GCM188R72A223KA37J; PACKAGE: 1608 Murata; PRICE: None
C61 C62 = C0805C105K3RACAUTO:C0805C105K3RACAUTO: CAP, CERAMIC, 1UF, 25V, X7R, 0805; Capacitance:1µF; Capacitance Tolerance:± 10%; Dielectric Characteristic:X7R; Voltage Rating:25V; Capacitor Case Style:0805 [2012 Metric]; Capacitor Terminals:SMD; Operating Temperature Range:-55°C ;RoHS Compliant: Yes; DESCRIPTION: 1µF ±10% 25V Ceramic Capacitor X7R 0805 _2012 Metric_; DIGI-KEY_PART_NUMBER: 399-6929-1-ND; DIGI-KEY_PURCHASE_URL: https://www.digikey.com/product-detail/en/kemet/C0805C105K3RACAUTO/399-6929-1-ND/3314439?utm_source=snapeda&utm_medium=aggregator&utm_campaign=symbol; MF: KEMET; MP: C0805C105K3RACAUTO; PACKAGE: 0805 KEMET
D21 D22 D31 D32 D41 D42 = BLDCBOMv3:PMEG6010EP,115: PMEG6010EP 1 A low VF MEGA Schottky barrier rectifier Source: Datasheet <https://componentsearchengine.com/Datasheets/1/PMEG6010EP,115.pdf>; DESCRIPTION: PMEG6010EP 1 A low VF MEGA Schottky barrier rectifier; HEIGHT: 1.1mm; MANUFACTURER_NAME: Nexperia; MANUFACTURER_PART_NUMBER: PMEG6010EP,115; MOUSER_PART_NUMBER: 771-PMEG6010EP115; MOUSER_PRICE-STOCK: https://www.mouser.com/Search/Refine.aspx?Keyword=771-PMEG6010EP115
D51 = BLDC:BZX84-A5V1,215: NEXPERIA - BZX84-A5V1,215 - DIODE, ZENER, 5.1V, 250MW, TO-236AB-3 Source: Datasheet <https://componentsearchengine.com/Datasheets/2/BZX84-A5V1,215.pdf>; DESCRIPTION: NEXPERIA - BZX84-A5V1,215 - DIODE, ZENER, 5.1V, 250MW, TO-236AB-3; FARNELL_PART_NUMBER: 2345405; FARNELL_PRICE-STOCK: http://uk.farnell.com/jsp/displayProduct.jsp?sku=2345405&action=view; HEIGHT: 1.1mm; MANUFACTURER_NAME: Nexperia; MANUFACTURER_PART_NUMBER: BZX84-A5V1,215
JP1 = BLDCBOMv3:214017: ERNI, 1.27mm Pitch 4 Way 1 Row Straight PCB Header, Solder Termination Source: Datasheet <https://componentsearchengine.com/Datasheets/1/214017.pdf>; DESCRIPTION: ERNI, 1.27mm Pitch 4 Way 1 Row Straight PCB Header, Solder Termination; HEIGHT: mm; MANUFACTURER_NAME: ERNI; MANUFACTURER_PART_NUMBER: 214017; MOUSER_PART_NUMBER: 305-214017; MOUSER_PRICE-STOCK: https://www.mouser.com/Search/Refine.aspx?Keyword=305-214017
JP2 = pinhead:PINHD-1X2: PIN HEADER
JP3 = pinhead:PINHD-1X3: PIN HEADER
L1 = BLDCBOMv3:HCM1A1305V2-R47-R: Inductor Power Shielded Wirewound 0.47uH/0.3uH 20% 100KHz Powdered Alloy 44A 0.00085Ohm DCR Automotive T/R Source: Datasheet <https://componentsearchengine.com/Datasheets/1/HCM1A1305V2-R47-R.pdf>; DESCRIPTION: Inductor Power Shielded Wirewound 0.47uH/0.3uH 20% 100KHz Powdered Alloy 44A 0.00085Ohm DCR Automotive T/R; HEIGHT: 5mm; MANUFACTURER_NAME: Eaton; MANUFACTURER_PART_NUMBER: HCM1A1305V2-R47-R; MOUSER_PART_NUMBER: 504-HCM1A1305V2R47-R; MOUSER_PRICE-STOCK: https://www.mouser.com/Search/Refine.aspx?Keyword=504-HCM1A1305V2R47-R
L2 = BLDCBOMv3:KMZ1608RHR102ATD25
LED = LTST-C170KRKT:LTST-C170KRKT: Green 2 x 1.25 x 1.1 mm 130° Water Clear 35 mcd 2 V Surface Mount LED; DESCRIPTION: Red 631nm LED Indication - Discrete 2V 0805 _2012 Metric_; DIGI-KEY_PART_NUMBER: 160-1415-1-ND; DIGI-KEY_PURCHASE_URL: https://www.digikey.com/product-detail/en/lite-on-inc/LTST-C170KRKT/160-1415-1-ND/386778?utm_source=snapeda&utm_medium=aggregator&utm_campaign=symbol; MF: Lite-On Inc.; MP: LTST-C170KRKT; PACKAGE: 0805 Lite-On
Q1-Q6 = BLDCBOMv3:NVMFS5C604NLAFT1G: ON SEMICONDUCTOR - NVMFS5C604NLAFT1G - MOSFET, AEC-Q101, N-CH, 60V, DFN Source: Datasheet <http://www.onsemi.com/pub/Collateral/NVMFS5C604NL-D.PDF>; DESCRIPTION: ON SEMICONDUCTOR - NVMFS5C604NLAFT1G - MOSFET, AEC-Q101, N-CH, 60V, DFN; HEIGHT: mm; MANUFACTURER_NAME: ON Semiconductor; MANUFACTURER_PART_NUMBER: NVMFS5C604NLAFT1G; MOUSER_PART_NUMBER: 863-NVMFS5C604NLFT1G; MOUSER_PRICE-STOCK: https://www.mouser.com/Search/Refine.aspx?Keyword=863-NVMFS5C604NLFT1G
Q7 Q8 = BLDCBOMv3:FDBL86361-F085: MOSFET NMOS TOLL 80V 1.4 MOHM Source: Datasheet <https://www.onsemi.com/pub/Collateral/FDBL86361_F085-D.PDF>; DESCRIPTION: MOSFET NMOS TOLL 80V 1.4 MOHM; HEIGHT: mm; MANUFACTURER_NAME: ON Semiconductor; MANUFACTURER_PART_NUMBER: FDBL86361-F085; MOUSER_PART_NUMBER: 512-FDBL86361F085; MOUSER_PRICE-STOCK: https://www.mouser.com/Search/Refine.aspx?Keyword=512-FDBL86361F085
Q9 = BLDCBOMv3:2N002BK
Q10 = BLDCBOMv3:BSS123N_H6327
R1 = CRA2512-FZ-R100ELF:CRA2512-FZ-R100ELF: Smd Current Sense Resistors, Cr Series, 0.1 Ohm, 3 W, - 1%, 2512 [6432 Metric]; DESCRIPTION: Resistor; Metal Film; Res 0.1 Ohms; Pwr-Rtg 3 W; Tol 1%; SMT; 2512; Current Sense; DIGI-KEY_PART_NUMBER: CRA2512-FZ-R100ELFCT-ND; DIGI-KEY_PURCHASE_URL: https://www.digikey.com/product-detail/en/bourns-inc/CRA2512-FZ-R100ELF/CRA2512-FZ-R100ELFCT-ND/1775059?utm_source=snapeda&utm_medium=aggregator&utm_campaign=symbol; MF: Bourns; MP: CRA2512-FZ-R100ELF; PACKAGE: 6432 Bourns
R2 R3 = BLDC:ESR03EZPF1001: Res 0603 1K Ohm 1% 1/4W ±100ppm/°C Molded SMD Paper T/R; AVAILABILITY: Unavailable; DESCRIPTION: Res Thick Film 0603 1K Ohm 1% 0.25W_1/4W_ }100ppm/ Molded SMD Automotive Paper T/R; MF: Rohm; MP: ESR03EZPF1001; PACKAGE: 1608 Rohm Semiconductor; PRICE: None
R4 = BLDC:CRCW060318K0FK: RES MF 18K 1/10W 1% AEC-Q200 0603
R5 = BLDC:CRCW060322K0FK: RES MF 22K 1/10W 1% AEC-Q200 0603
R6 R11 = BLDC:CRCW0603120RFK: RES MF 120R 1/10W 1% AEC-Q200 0603
R7 R9 = BLDC:CRCW060310K0FKEB: Res Thick Film 0603 10K Ohm 1% 0.1W(1/10W) ±100ppm/C Molded SMD Automotive Paper T/R; AVAILABILITY: Unavailable; DESCRIPTION: 10 kOhms ±1% 0.1W, 1/10W Chip Resistor 0603 _1608 Metric_ Automotive AEC-Q200 Thick Film; MF: Vishay Dale; MP: CRCW060310K0FKEB; PACKAGE: 1508 Vishay; PRICE: None
R8 R10 R21 R24 = BLDC:CRCW06031K00FKEA: Res Thick Film 0603 1K Ohm 1% 1/10W Â±100ppm/Â°C Molded SMD Paper T/R; AVAILABILITY: Unavailable; DESCRIPTION: 1 kOhms ±1% 0.1W, 1/10W Chip Resistor 0603 _1608 Metric_ Automotive AEC-Q200 Thick Film; MF: Vishay; MP: CRCW06031K00FKEA; PACKAGE: 1508 Vishay; PRICE: None
R20 R23 R30 R33 R40 R43 = BLDC:CRCW060333R0FKEAHP: RES, TF, 33R, 1%, 1/4 W, AEC-Q200, 0603
R22 R25 R32 R35 R42 R45 = SG73P1JTTD2R20F:SG73P1JTTD2R20F; DESCRIPTION: 2.2 Ohms ±1% 0.333W, 1/3W Chip Resistor 0603 _1608 Metric_ Automotive AEC-Q200, Moisture Resistant, Pulse Withstanding Thick Film; DIGI-KEY_PART_NUMBER: 2019-SG73P1JTTD2R20FTR-ND; DIGI-KEY_PURCHASE_URL: https://www.digikey.com/product-detail/en/koa-speer-electronics-inc/SG73P1JTTD2R20F/2019-SG73P1JTTD2R20FTR-ND/10188384?utm_source=snapeda&utm_medium=aggregator&utm_campaign=symbol; MF: KOA Speer; MP: SG73P1JTTD2R20F; PACKAGE: 1608 KOA
R31 R34 R41 R44 = BLDC:CRCW0603100KFKEA: Res Thick Film 0603 100K Ohm 1% 1/10W Â±100ppm/Â°C Molded SMD Paper T/R; AVAILABILITY: Unavailable; DESCRIPTION: 100 kOhms ±1% 0.1W, 1/10W Chip Resistor 0603 _1608 Metric_ Thick Film; MF: Vishay Dale; MP: CRCW0603100KFKEAC; PACKAGE: 1608 Rohm Semiconductor; PRICE: None
TVS = BLDCBOMv3:SMBJ30AQ-13-F: 600W SURFACE MOUNT AUTOMOTIVE TRANSIENT VOLTAGE SUPPRESSOR Source: Datasheet <https://componentsearchengine.com/Datasheets/1/SMBJ30AQ-13-F.pdf>; DESCRIPTION: 600W SURFACE MOUNT AUTOMOTIVE TRANSIENT VOLTAGE SUPPRESSOR; HEIGHT: 2.5mm; MANUFACTURER_NAME: Diodes Inc.; MANUFACTURER_PART_NUMBER: SMBJ30AQ-13-F; MOUSER_PART_NUMBER: 621-SMBJ30AQ-13-F; MOUSER_PRICE-STOCK: https://www.mouser.com/Search/Refine.aspx?Keyword=621-SMBJ30AQ-13-F
TVS+ = SMBJ58A-Q:SMBJ58A-Q: SMBJ-Q Transient Voltage Suppressor Diode Series . Source: Datasheet <https://componentsearchengine.com/Datasheets/1/SMBJ58A-Q.pdf>; DESCRIPTION: SMBJ-Q Transient Voltage Suppressor Diode Series .; HEIGHT: 2.44mm; MANUFACTURER_NAME: Bourns; MANUFACTURER_PART_NUMBER: SMBJ58A-Q; MOUSER_PART_NUMBER: 652-SMBJ58A-Q; MOUSER_PRICE-STOCK: https://www.mouser.com/Search/Refine.aspx?Keyword=652-SMBJ58A-Q
TVS- = BLDCBOMv3:SMBJ26A-Q: SMBJ-Q Transient Voltage Suppressor Diode Series Source: Datasheet <https://componentsearchengine.com/Datasheets/1/SMBJ26A-Q.pdf>; DESCRIPTION: SMBJ-Q Transient Voltage Suppressor Diode Series; HEIGHT: 2.44mm; MANUFACTURER_NAME: Bourns; MANUFACTURER_PART_NUMBER: SMBJ26A-Q; MOUSER_PART_NUMBER: 652-SMBJ26A-Q; MOUSER_PRICE-STOCK: https://www.mouser.com/Search/Refine.aspx?Keyword=652-SMBJ26A-Q
U1 = BLDCBOMv3:A4964EVTR-T: Sensorless Sinusoidal Drive BLDC Controller
U2 = BLDCBOMv3:LM74700-Q1MKX-1_NOPB: LM74700-Q1 Low IQ Reverse Battery Protection Ideal Diode Controller Source: Datasheet <http://www.ti.com/lit/ds/symlink/lm74700-q1.pdf>; DESCRIPTION: LM74700-Q1 Low IQ Reverse Battery Protection Ideal Diode Controller; HEIGHT: 1.45mm; MANUFACTURER_NAME: Texas Instruments; MANUFACTURER_PART_NUMBER: LM74700-Q1MKX-1/NOPB
U3 = BLDC:LMT86QDCKRQ1: Automotive Grade, 2.2V-Capable, 10 uA Analog Output Temperature Sensor Source: Datasheet <http://www.ti.com/lit/gpn/lmt86-q1>; DESCRIPTION: Automotive Grade, 2.2V-Capable, 10 uA Analog Output Temperature Sensor; HEIGHT: 1.1mm; MANUFACTURER_NAME: Texas Instruments; MANUFACTURER_PART_NUMBER: LMT86QDCKRQ1; MOUSER_PART_NUMBER: 595-LMT86QDCKRQ1; MOUSER_PRICE-STOCK: https://www.mouser.com/Search/Refine.aspx?Keyword=595-LMT86QDCKRQ1
U4 = STM8AF6223PDU:STM8AF62X3; COPYRIGHT: Copyright (C) 2016 Accelerated Designs. All rights reserved; MANUFACTURER_PART_NUMBER: STM8AF62X3; VENDOR: STMicroelectronics
U$1-U$4 = BLDCBOMv3:FIDUCIAL: For use by pick and place machines to calibrate the vision/machine, 1mm By microbuilder.eu
X2 = ME507:SCREWTERM_4P: PHOENIX CONNECTOR
X3 = ME507:SCREWTERM_2P: PHOENIX CONNECTOR

## Board
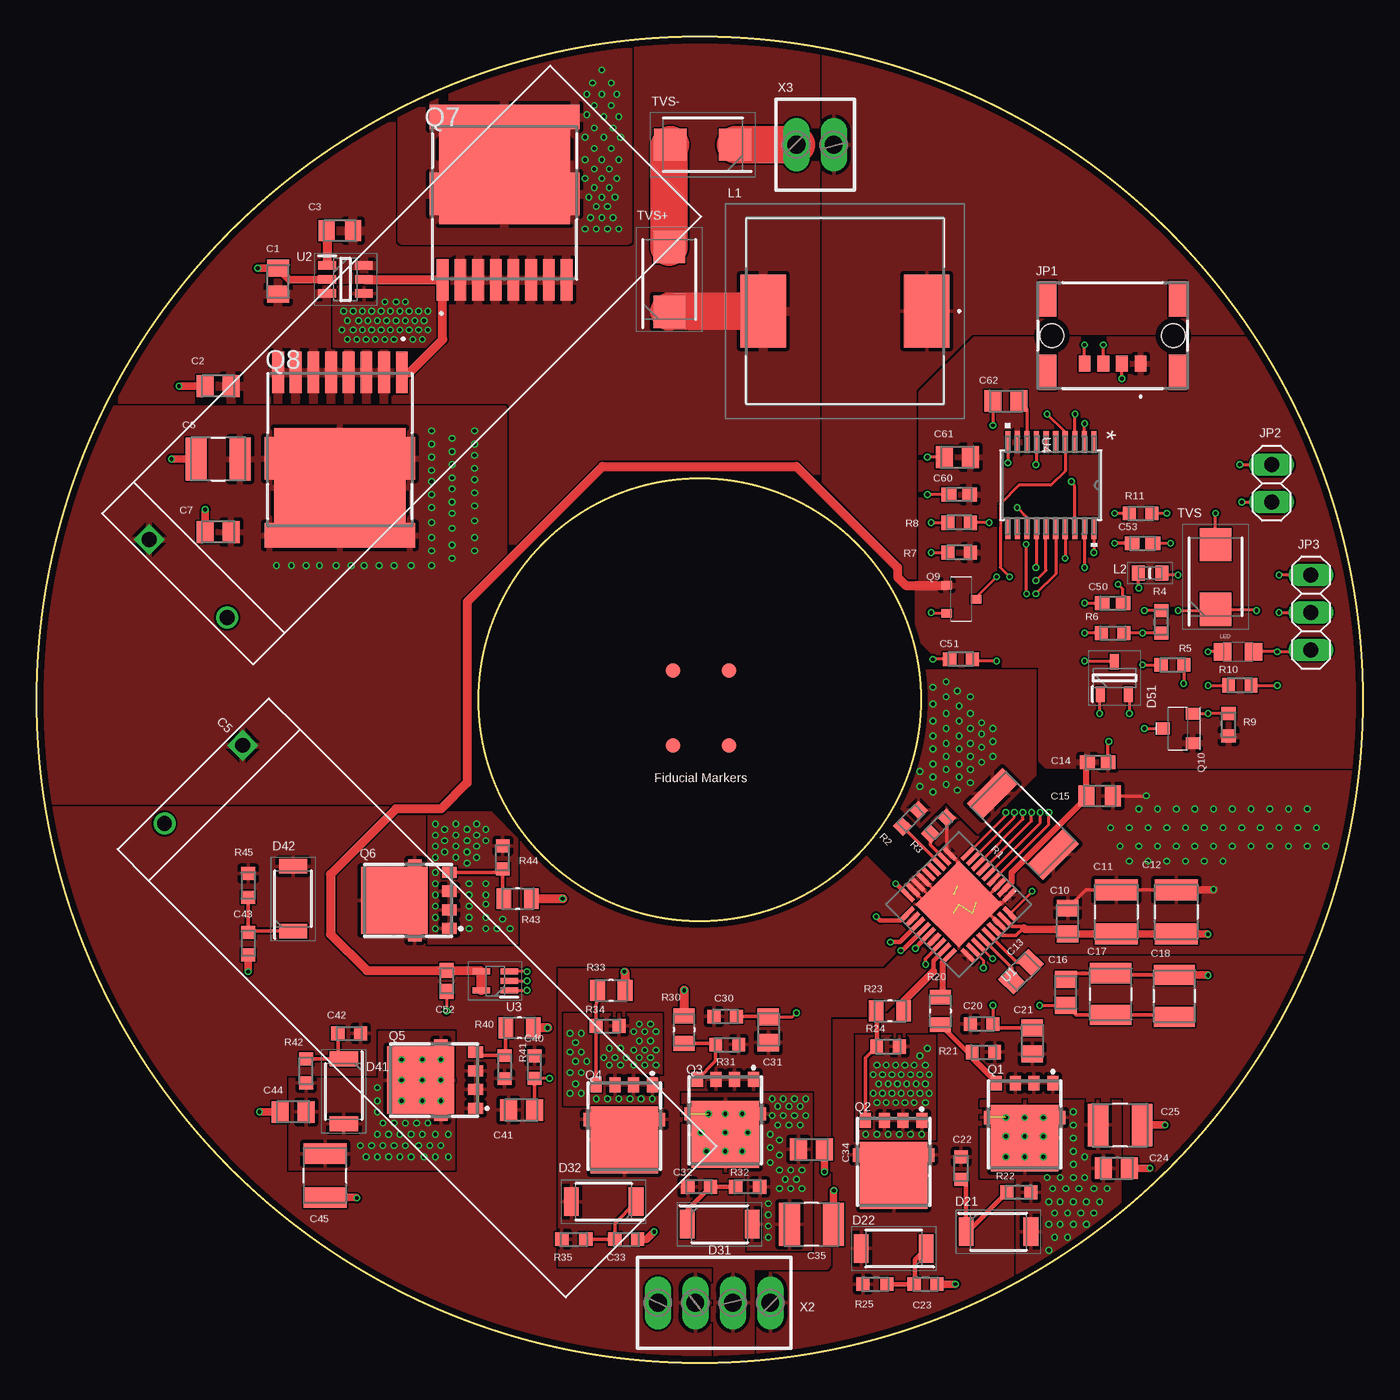
[diagram p6: board, top side]
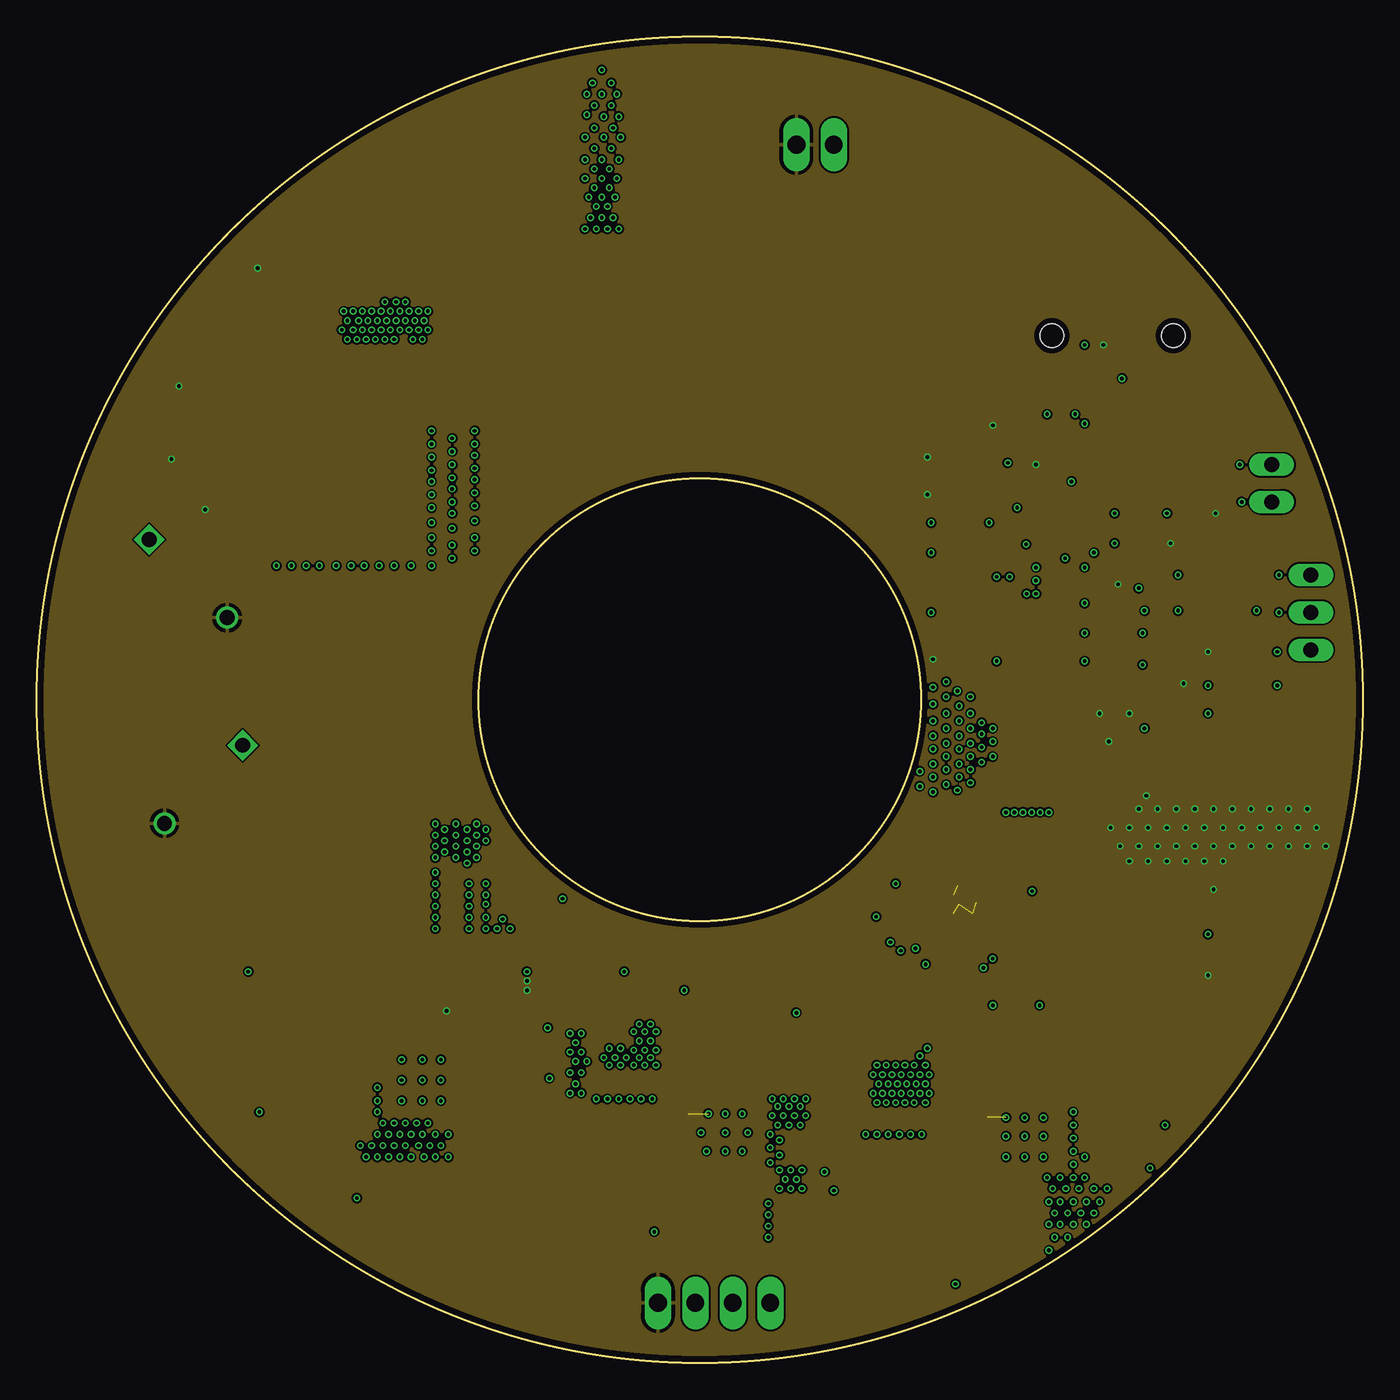
[diagram p7: board, inner layer Route2]
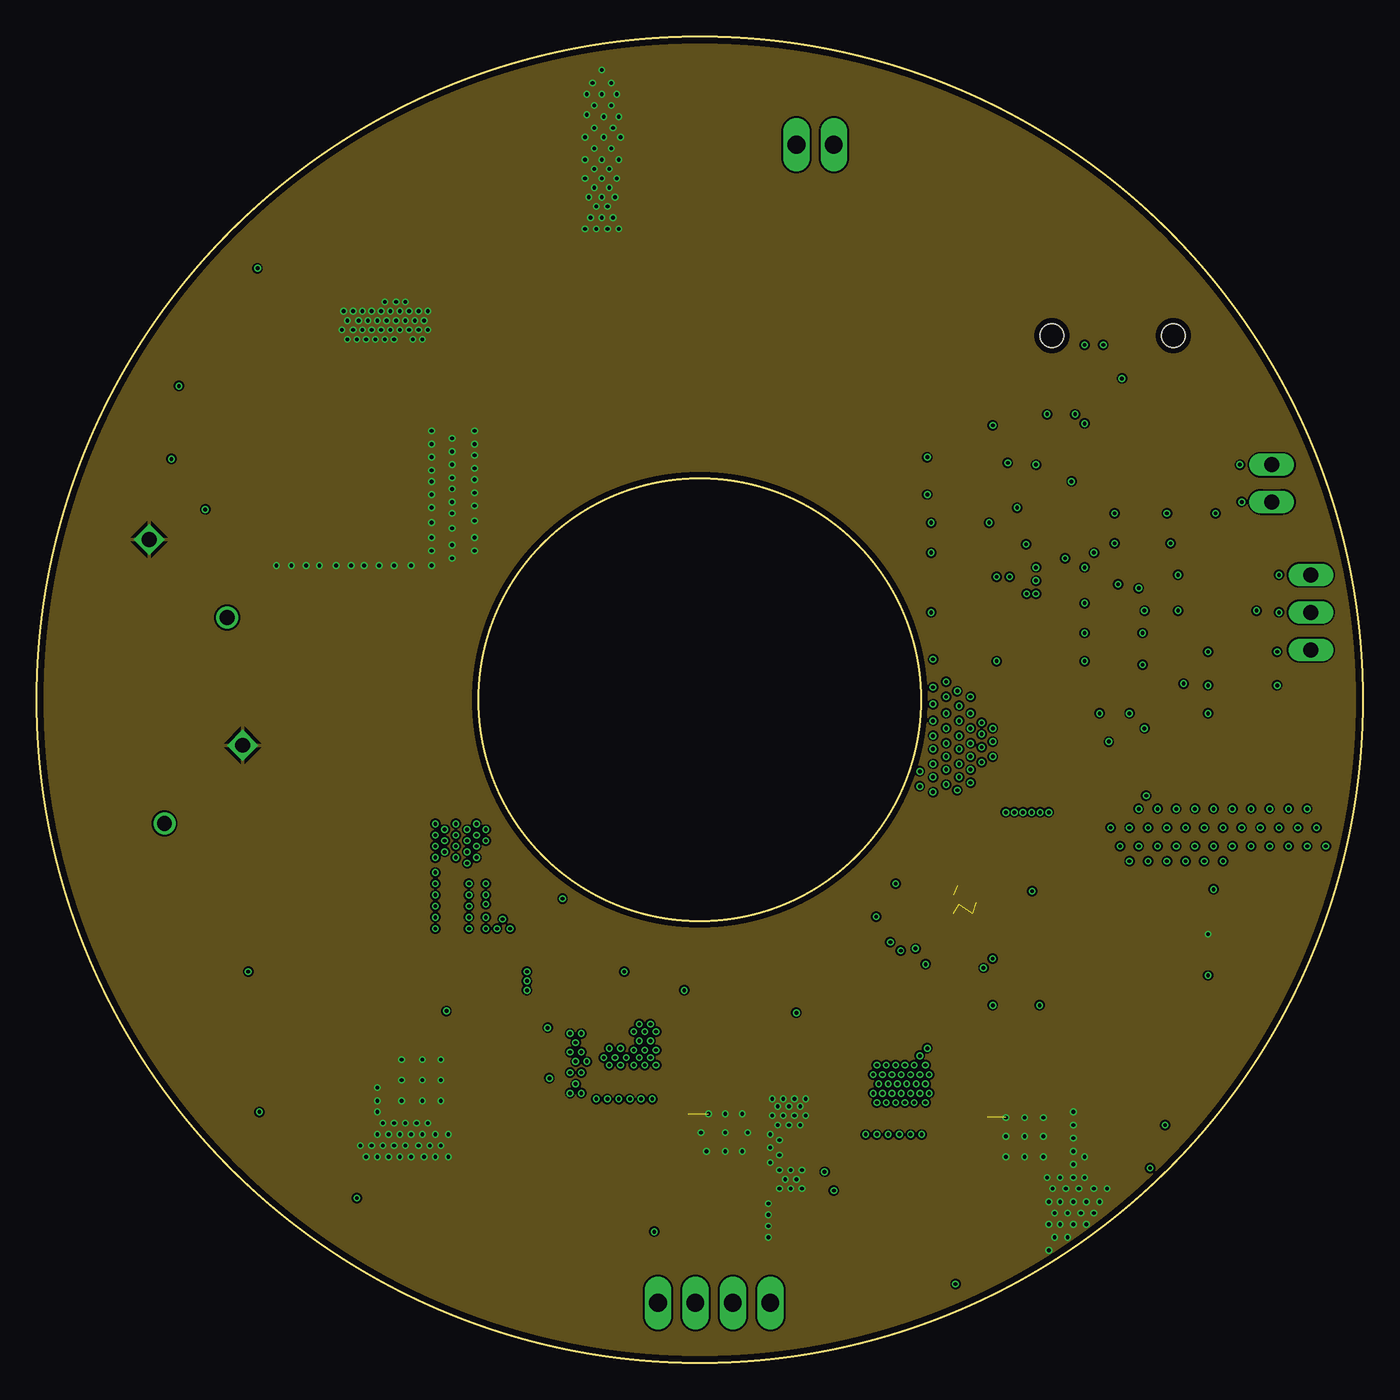
[diagram p8: board, inner layer Route15]
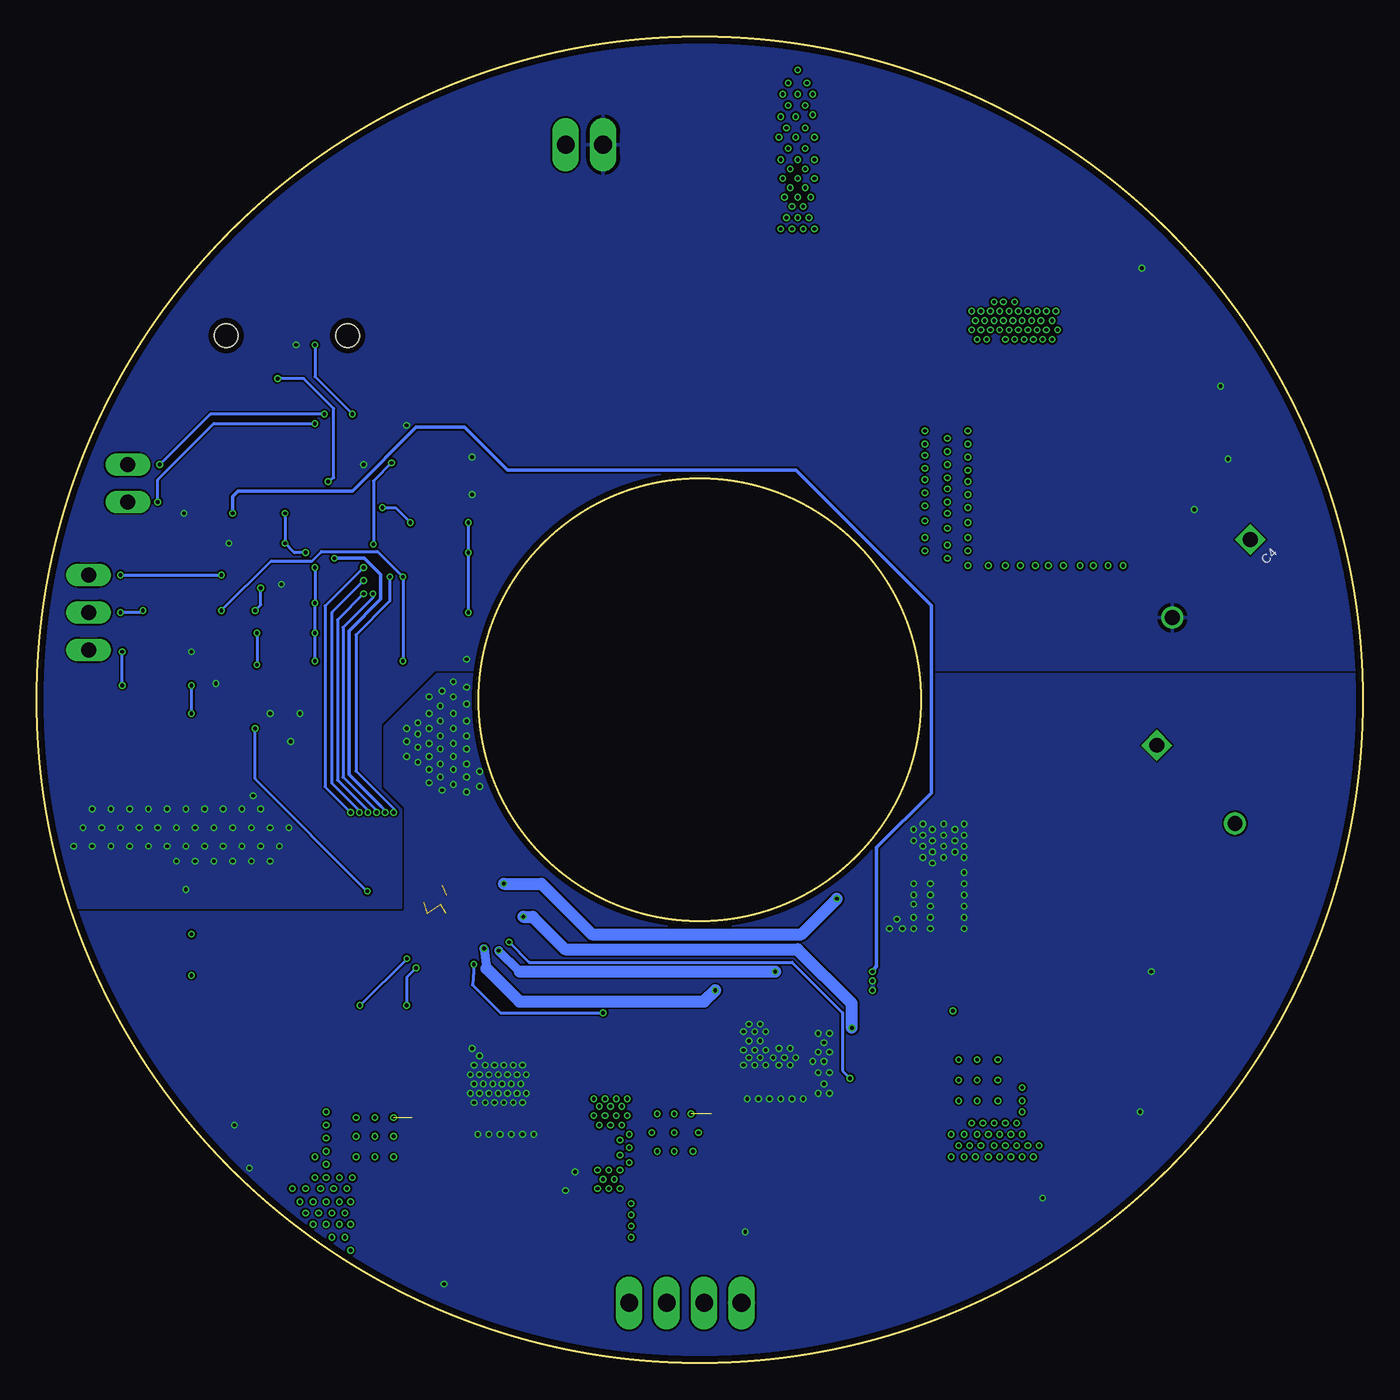
[diagram p9: board, bottom side, seen from below]

Size 90 x 90 mm. Coordinates in mm from the lower left corner, seen from the top.
Outline: circle at 45,45 radius 15
Outline: circle at 45,45 radius 45
Copper layers (1*2*15*16): Top 0.035559375mm / dielectric 0.17018125mm / Route2 0.01778125mm / dielectric 47mil / Route15 0.01778125mm / dielectric 0.17018125mm / Bottom 0.035559375mm
Design rules "oshpark-4layer *": minimum track width 5mil, minimum drill 10mil, track to track 5mil, track to pad 5mil, pad to pad 5mil, via to via 5mil, smd to smd 5mil, copper to edge 15mil, drill to drill 6mil, minimum pad ring 4mil, minimum via ring 4mil, stop-mask expansion 2.5mil, vias tented up to drill 0mil, thermal gap 10mil

### Footprints (pad centres in the part's own frame; a part is rotated, then mirrored left to right if it is on the bottom)
CAPC2012X145N = smd 1.15 x 1.47: 1 -0.88,0; 2 0.88,0
CAPC2012X140N = smd 1.08 x 1.42: 1 -0.895,0; 2 0.895,0
CAPPRD750W80D1475H4150(HORIZONTAL) = drill 1 pad 1.5 square: 1 0,0 | drill 1 pad 1.5: 2 7.5,0
CAPC3326X230N = smd 1.42 x 2.91: 1 -1.492,0; 2 1.492,0
CAPC2012X140N' = smd 1.16 x 1.47: 1 -0.88,0; 2 0.88,0
CAPC1608X90N = smd 1.01 x 0.93: 1 -0.709,0; 2 0.709,0
CAPC3225X280N = smd 1.37 x 2.81: 1 -1.42,0; 2 1.42,0
CAPC1608X90N' = smd 0.89 x 0.93: 1 -0.77,0; 2 0.77,0
CAPC2012X88N = smd 1.16 x 1.47: 1 -0.875,0; 2 0.875,0
SODFL4725X110N = smd 1 x 1.93: 1 -2.2,0; 2 2.2,0
SOT95P230X110-3N = smd 1.05 x 0.6: 1 -1.1,0.95; 2 -1.1,-0.95; 3 1.1,0
214017 = smd 0.8 x 1.1: 1 1.905,-1.9; 2 0.635,-1.9; 3 -0.635,-1.9; 4 -1.905,-1.9 | smd 1.2 x 2.4: 5 -4.415,-2.5; 6 -4.415,2.5; 7 4.415,2.5; 8 4.415,-2.5 | hole 1.6: -4.115,0; 4.115,0
1X02 = drill 1.016 long: 1 -1.27,0; 2 1.27,0
1X03 = drill 1.016 long: 1 -2.54,0; 2 0,0; 3 2.54,0
HCM1A1305V2R47R = smd 3.1 x 4.95: 1 -5.55,0; 2 5.55,0
BEADC1608X95N = smd 0.9 x 1: 1 -0.8,0; 2 0.8,0
DIOC200X125X110 = smd 1.2 x 1.2: + 1.05,0; - -1.05,0
DFN5_5X6(SO-8FL)_CASE-488AA_IS = smd 0.75 x 1: 1 -1.905,-2.345; 2 -0.635,-2.345; 3 0.635,-2.345; 4 1.905,-2.345 | smd 4.56 x 4.53: 5 0,1.385 | smd 0.495 x 0.905: 6 -2.527,0; 7 2.527,0
H-PSOF8L-11.68X9.80_1 = smd 0.8 x 2.8: 1 -4.2,-5.24; 2 -3,-5.24; 3 -1.8,-5.24; 4 -0.6,-5.24; 5 0.6,-5.24; 6 1.8,-5.24; 7 3,-5.24; 8 4.2,-5.24 | smd 8.9 x 8.1: 9 0,2.59 | smd 0.65 x 1.65: 10 -4.775,5.815; 11 4.775,5.815 | smd 0.65 x 2.9: 12 -4.775,0.59; 13 4.775,0.59
2N7002BK = smd 0.7 x 0.6: 1 2,-0.95; 2 2,0.95; 3 0,0
BSS123N_H6327 = smd 0.9 x 0.8: 1 2,-1; 2 2,1; 3 0,0
RESC6432X90N = smd 1.49 x 3.42: 1 -2.914,0; 2 2.914,0
RESC1608X55N = smd 0.87 x 0.93: 1 -0.78,0; 2 0.78,0
RESC1508X50N = smd 0.86 x 0.98: 1 -0.765,0; 2 0.765,0
0805RES = smd 1 x 1.42: 1 -0.935,0; 2 0.935,0
RESC1608X55N' = smd 0.89 x 0.93: 1 -0.814,0; 2 0.814,0
DIOM5336X250N = smd 2.25 x 2.15: 1 -2.2,0; 2 2.2,0
DIOM5436X244N = smd 2.2 x 2.15: 1 -2.2,0; 2 2.2,0
A4964EVTR-T = smd 1.15 x 0.3: 1 0,0; 2 0,-0.5; 3 0,-1; 4 0,-1.5; 5 0,-2; 6 0,-2.5; 7 0,-3; 8 0,-3.5; 9 0,-4; 19 5.8,-4; 20 5.8,-3.5; 21 5.8,-3; 22 5.8,-2.5; 23 5.8,-2; 24 5.8,-1.5; 25 5.8,-1; 26 5.8,-0.5; 27 5.8,0 | smd 0.3 x 1.15: 10 0.9,-4.9; 11 1.4,-4.9; 12 1.9,-4.9; 13 2.4,-4.9; 14 2.9,-4.9; 15 3.4,-4.9; 16 3.9,-4.9; 17 4.4,-4.9; 18 4.9,-4.9; 28 4.9,0.9; 29 4.4,0.9; 30 3.9,0.9; 31 3.4,0.9; 32 2.9,0.9; 33 2.4,0.9; 34 1.9,0.9; 35 1.4,0.9; 36 0.9,0.9 | smd 4.15 x 4.15: 37 2.9,-2
SOT95P280X145-6N = smd 1.2 x 0.6: 1 -1.25,0.95; 2 -1.25,0; 3 -1.25,-0.95; 4 1.25,-0.95; 5 1.25,0; 6 1.25,0.95
SOT65P210X110-5N = smd 1.2 x 0.4: 1 -0.95,0.65; 2 -0.95,0; 3 -0.95,-0.65; 4 0.95,-0.65; 5 0.95,0.65
TSSOP20 = smd 1.473 x 0.356: 1 -2.921,2.925; 2 -2.921,2.275; 3 -2.921,1.625; 4 -2.921,0.975; 5 -2.921,0.325; 6 -2.921,-0.325; 7 -2.921,-0.975; 8 -2.921,-1.625; 9 -2.921,-2.275; 10 -2.921,-2.925; 11 2.921,-2.925; 12 2.921,-2.275; 13 2.921,-1.625; 14 2.921,-0.975; 15 2.921,-0.325; 16 2.921,0.325; 17 2.921,0.975; 18 2.921,1.625; 19 2.921,2.275; 20 2.921,2.925
FIDUCIAL_1MM = smd 1 x 1: 1 0,0
4POL254 = drill 1.2 long: 1 -3.81,0; 2 -1.27,0; 3 1.27,0; 4 3.81,0
2POL254 = drill 1.2 long: 1 -1.27,0; 2 1.27,0

### Placement (x,y rotation side)
C1  16.38,73.41 270 top
C2  12.32,66.29 0 top
C3  20.57,76.83 0 top
C4  7.62,55.88 315 top
C5  13.97,41.91 225 top
C6  12.32,61.34 0 top
C7  12.32,56.39 0 top
C10  69.98,29.97 270 top
C11  73.28,30.61 270 top
C12  77.34,30.61 270 top
C13  .47uF, 100V  [CAPC2012X140N']  66.8,26.54 225 top
C14  72.01,40.77 180 top
C15  72.14,38.48 180 top
C16  69.85,25.15 270 top
C17  72.9,25.02 270 top
C18  77.22,24.89 270 top
C20  .01uF, 100V  [CAPC1608X90N']  64.14,22.99 0 top
C21  .47uF, 100V  [CAPC2012X140N']  67.56,21.84 90 top
C22  3300pF, 100V  [CAPC1608X90N']  62.74,13.21 270 top
C23  3300pF, 100V  [CAPC1608X90N']  60.33,5.33 180 top
C24  73.28,13.21 180 top
C25  73.53,16.13 180 top
C30  .01uF,100V  [CAPC1608X90N']  46.74,23.5 0 top
C31  .47uF, 100V  [CAPC2012X140N']  49.66,22.61 90 top
C32  3300pF, 100V  [CAPC1608X90N']  44.96,11.94 0 top
C33  3300pF, 100V  [CAPC1608X90N']  40.01,8.38 180 top
C34  52.58,14.48 180 top
C35  52.58,9.4 180 top
C40  .01uF, 100V  [CAPC1608X90N']  33.78,20.07 270 top
C41  .47uF, 100V  [CAPC2012X140N']  32.89,17.14 0 top
C42  3300pF, 100V  [CAPC1608X90N']  21.21,22.35 180 top
C43  3300pF, 100V  [CAPC1608X90N']  14.35,28.45 90 top
C44  17.4,17.02 0 top
C45  19.56,12.7 90 top
C50  73.03,51.56 180 top
C51  .01uF, 100V  [CAPC1608X90N']  62.74,47.75 0 top
C52  27.81,25.91 90 top
C53  75.06,55.63 180 top
C60  62.61,58.93 0 top
C61  62.48,61.47 180 top
C62  65.79,65.28 180 top
D21  65.28,8.89 0 top
D22  58.17,7.75 180 top
D31  46.35,9.4 0 top
D32  38.48,10.92 180 top
D41  20.83,18.41 270 top
D42  17.4,31.5 90 top
D51  73.15,46.48 90 top
JP1  73.03,69.72 0 top
JP2  83.82,59.69 270 top
JP3  86.49,50.93 90 top
L1  54.86,71.37 180 top
L2  75.56,53.59 180 top
LED  81.53,48.26 0 top
Q1  67.06,16.64 180 top
Q2  58.17,14.1 180 top
Q3  46.74,16.89 180 top
Q4  39.88,16.51 180 top
Q5  27.43,19.18 90 top
Q6  25.65,31.37 90 top
Q7  31.75,78.74 0 top
Q8  20.57,61.98 180 top
Q9  63.75,51.82 180 top
Q10  76.45,43.05 0 top
R1  66.93,36.58 135 top
R2  59.31,36.96 45 top
R3  61.21,36.45 45 top
R4  90.9k, .1W  [CAPC1608X90N']  76.33,50.29 270 top
R5  10k, .1W  [CAPC1608X90N']  77.09,47.37 180 top
R6  120, .1W  [CAPC1608X90N']  73.03,49.53 180 top
R7  62.61,54.99 0 top
R8  62.61,57.02 0 top
R9  80.9,43.31 270 top
R10  81.66,45.97 0 top
R11  120, .1W  [CAPC1608X90N']  74.93,57.66 180 top
R20  61.34,23.88 270 top
R21  64.26,21.08 180 top
R22  2R2, .33W  [RESC1608X55N']  66.67,11.56 0 top
R23  57.91,23.88 180 top
R24  57.78,21.46 180 top
R25  2R2, .33W  [RESC1608X55N']  56.9,5.33 180 top
R30  43.94,22.61 270 top
R31  46.86,21.59 180 top
R32  2R2, .33W  [RESC1608X55N']  48.26,11.94 0 top
R33  38.99,25.27 180 top
R34  38.73,22.86 180 top
R35  2R2, .33W  [RESC1608X55N']  36.45,8.38 180 top
R40  32.77,22.73 180 top
R41  31.75,20.07 90 top
R42  2R2, .33W  [RESC1608X55N']  18.29,19.81 270 top
R43  32.64,31.5 180 top
R44  31.62,34.29 270 top
R45  2R2, .33W  [RESC1608X55N']  14.35,32.38 90 top
TVS  80.01,53.34 90 top
TVS+  42.93,73.53 90 top
TVS-  45.21,82.68 180 top
U1  66.04,31.75 225 top
U2  20.95,73.53 0 top
U3  31.11,25.91 180 top
U4  68.83,59.56 270 top
U$1  46.99,46.99 0 top
U$2  46.99,41.91 0 top
U$3  43.18,46.99 0 top
U$4  43.18,41.91 0 top
X2  45.97,4.06 180 top
X3  52.83,82.68 0 top

### Tracks (layer width: path | path; a pad name or v marks a point on that pad's centre or on a via)
+24V
  pour Top: 53.34,96.52 53.34,52.07 59.69,52.07 59.69,66.04 63.5,69.85 96.52,69.85 96.52,96.52
ANALOG_CMD  (via drill 0.25 pad 0.3)
  Top 0.2: JP3.3 v84.33,53.47 | v77.47,53.47 76.49,53.47 L2.1
  Bottom 0.2: v84.33,53.47 v77.47,53.47
ANALOGIN  (via drill 0.25 pad 0.3)
  Top 0.2: U4.19 71.11,53.99 v71.12,53.98 | v71.12,51.56 C50.2 | R6.2 v71.12,49.53 | D51.3 71.16,47.58 v71.12,47.62
  Bottom 0.2: v71.12,53.98 v71.12,51.56 v71.12,49.53 v71.12,47.62
CA  (via drill 0.25 pad 0.3)
  Top 0.2: U1.29 64.26,27.3 v64.26,26.8 | v64.9,24.26 64.9,23 C20.2
  Top 0.254: C20.2 65.17,22.72 C21.2
  Bottom 0.2: v64.26,26.8 64.9,26.16 v64.9,24.26
CB  (via drill 0.25 pad 0.3)
  Top 0.2: C31.2 51.3,23.49 v51.56,23.75
  Top 0.254: C31.2 49.65,23.5 C30.2 | v60.33,27.04 60.3,27.37 60.3,27.42 U1.25
  Bottom 0.2: v60.33,27.04 60.42,25.64 58.53,23.75 v51.56,23.75
CC  (via drill 0.25 pad 0.3)
  Top 0.2: v34.8,19.3 v34.79,19.3 C40.2
  Top 0.254: C40.2 C41.2
  Top 0.305: v57.94,28.55 58.59,28.55 U1.21
  Bottom 0.2: v57.94,28.55 56.57,27.18 38.73,27.18 35.31,23.75 35.31,19.81 v34.8,19.3
CSM
  Top 0.254: U1.11 60.66,35.15 R3.1
CSP
  Top 0.254: U1.12 61.23,33.93 R2.1
CSP/CSM  (via drill 0.25 pad 0.3)
  Top 0.508: C43.1 v14.35,26.54 | C44.1 v15.11,17.02 | C45.1 21.68,11.21 v21.72,11.18 | C33.1 41.4,8.38 v41.91,8.89 | C35.1 54.07,11.65 v54.1,11.68 | C34.1 53.46,12.96 v53.47,12.95 | C23.1 v62.36,5.33 | C25.1 v76.58,16.13 | C24.1 v75.56,13.21
  other vias: 27.69,35.43 27.05,36.58 27.69,36.2 28.45,36.58 29.84,36.58 27.05,35.81 27.05,35.05 27.05,34.29 27.05,33.27 27.05,32.51 27.05,31.75 27.05,30.99 27.05,30.23 27.05,29.46 28.45,35.81 29.21,36.2 29.84,35.81 29.21,35.43 28.45,35.05 27.69,34.67 28.45,34.29 29.21,34.67 29.84,35.05 29.84,34.29 29.21,33.91 29.34,32.51 29.34,31.75 30.48,32.51 29.34,30.99 29.34,30.23 29.34,29.46 30.48,31.75 30.48,31.11 30.48,30.23 30.48,29.46 30.48,35.43 30.48,36.2 31.62,30.1 31.24,29.46 32.13,29.46 36.2,22.35 36.96,22.35 36.58,21.72 36.2,21.08 36.96,21.08 36.58,20.45 37.34,20.45 36.96,19.68 36.2,19.68 36.58,18.92 36.2,18.29 36.96,18.29 37.97,17.91 38.73,17.91 39.5,17.91 40.26,17.91 41.02,17.91 41.78,17.91 38.86,21.34 38.48,20.7 39.24,20.7 38.86,20.19 39.62,21.34 40.51,22.48 40.89,22.99 41.66,22.99 42.04,22.48 41.66,21.84 41.27,22.48 40.89,21.84 40.51,21.21 40.01,20.7 39.62,20.19 40.89,20.7 41.27,21.21 42.04,21.21 41.66,20.7 40.51,20.19 41.27,20.19 42.04,20.19 60.83,45.85 60.83,44.7 60.83,43.56 60.83,42.55 60.83,41.66 59.94,40.13 59.94,39.12 60.83,40.64 60.83,39.75 60.83,38.73 61.72,46.23 61.72,45.21 61.72,44.07 61.72,43.05 61.72,42.04 61.72,41.15 61.72,40.26 61.72,39.24 62.48,45.59 62.61,44.58 62.61,43.56 62.61,42.55 62.61,41.66 62.61,40.64 62.61,39.75 62.48,38.86 63.37,45.21 63.37,44.07 63.37,43.05 63.37,42.04 63.37,41.15 63.37,40.26 63.37,39.37 64.14,43.43 64.14,42.67 64.14,41.78 64.14,40.77 64.9,43.05 64.9,42.16 64.9,41.15 60.45,21.34 59.94,20.83 57.02,20.19 57.66,20.19 58.29,20.19 58.93,20.19 59.56,20.19 60.33,20.19 56.77,19.56 57.4,19.56 58.04,19.56 58.67,19.56 59.31,19.56 59.94,19.56 60.58,19.56 57.15,18.92 57.78,18.92 58.42,18.92 59.05,18.92 59.69,18.92 60.33,18.92 56.77,18.29 57.4,18.29 58.04,18.29 58.67,18.29 59.31,18.29 59.94,18.29 60.58,18.29 57.02,17.65 57.66,17.65 58.29,17.65 58.93,17.65 59.56,17.65 60.33,17.65 56.26,15.49 57.02,15.49 57.78,15.49 58.55,15.49 59.31,15.49 60.07,15.49
  pour Top: 55.63,22.23 60.96,22.23 60.96,15.11 55.63,15.11
  pour Top: 35.81,23.62 35.81,17.53 42.42,17.53 42.42,23.62
  pour Top: 57.91,38.35 59.94,36.32 61.72,38.1 63.88,35.94 67.82,39.88 67.82,40.39 67.82,46.99 58.04,46.99 57.91,46.86
  pour Bottom: -1.65,46.74 62.87,46.74 66.42,43.18 66.42,39.12 65.02,37.72 65.02,30.73 65.15,30.61 88.52,30.61 88.52,-1.91 -1.65,-1.91
  pour Top: 26.54,37.34 26.54,28.45 32.64,28.45 32.64,35.56 30.86,37.34 30.61,37.34
DIAG  (via drill 0.25 pad 0.3)
  Top 0.2: U1.36 v67.56,32 | v75.18,43.05 Q10.3
  Bottom 0.2: v67.56,32 75.18,39.62 v75.18,43.05
DIAGOUT  (via drill 0.25 pad 0.3)
  Top 0.2: R10.2 v84.2,45.97 | LED.+ v84.2,48.26 86.36,48.26 JP3.1
  Bottom 0.2: v84.2,45.97 v84.2,48.26
GHA
  Top 0.2: 61.48,24.95 R20.1
  Top 0.305: U1.27 61.48,27.19
  Top 0.406: 61.48,27.19 61.48,24.95
GHB  (via drill 0.25 pad 0.3)
  Top 0.2: v59.64,28.11
  Top 0.305: U1.23 v59.64,28.11
  Top 0.61: v43.94,25.27 R30.1
  Bottom 0.61: v59.64,28.11 59.48,26.75
  Bottom 0.813: 59.48,26.75 57.24,24.51 44.7,24.51 v43.94,25.27
GHC  (via drill 0.25 pad 0.3)
  Top 0.2: U1.19 58.65,30.02
  Top 0.305: 58.65,30.02 57.23,30.02 v56.98,30.27
  Top 0.61: v34.67,22.73 R40.1
  Bottom 0.813: v56.98,30.27 56.34,30.27 54.14,28.07 38.35,28.07 34.67,24.38 v34.67,22.73
GLA
  Top 0.2: 58.85,24.56 R23.1
  Top 0.305: U1.26 60.85,27.27 60.85,26.56
  Top 0.508: 60.85,26.56 58.85,24.56
GLB  (via drill 0.25 pad 0.3)
  Top 0.2: 58.72,27.97 v58.65,27.97 | v39.88,26.54 39.92,26.5
  Top 0.305: U1.22 58.72,27.97
  Top 0.61: 39.92,26.5 R33.1
  Bottom 0.61: v58.65,27.97 57.23,26.54
  Bottom 0.813: 57.23,26.54 v39.88,26.54
GLC  (via drill 0.25 pad 0.3)
  Top 0.2: 58.35,32.51 v58.29,32.51
  Top 0.305: U1.18 58.35,32.51
  Top 0.61: v35.69,31.5 R43.1
  Bottom 0.813: v58.29,32.51 55.75,32.51 52.32,29.08 38.1,29.08 v35.69,31.5
GND  (via drill 0.25 pad 0.3)  (4 unrouted)
  Top 0.2: U1.15 61.23,31.75 62.23,31.75 | U1.16 61.38,30.9 | 61.38,30.9 61.8,30.48 62.23,30.48 | U1.17 60.67,30.9 61.38,30.9 | C61.2 v60.45,61.47 | C60.1 v60.45,58.93 | C62.2 64.91,63.64 v64.9,63.63 | TVS.2 v80.01,57.66 | C52.1 v27.81,23.88 | LED.- v79.5,48.26 | R5.1 v77.86,46.11 v77.85,46.1 | D51.2 74.17,45.32 v74.17,44.07 | 72.17,45.35 72.14,45.32 v72.14,44.07 | C51.1 v60.83,47.75 | JP1.3 v72.39,69.09 | U3.1 33.26,25.26 v33.27,25.27 | U3.2 v33.27,25.91 | C53.1 v76.96,55.63 | C50.1 73.73,52.5 v73.41,52.83 | C15.1 v75.31,38.48 | C14.1 72.72,42.11 v72.77,42.16 | U4.7 67.86,61 v67.82,60.96
  Top 0.254: D51.1 72.17,45.35 | C16.1 70.26,26.44 C17.1 73.03,26.31 C18.1 | C10.1 71.22,32.1 C11.1 C12.1 | R3.2 61.77,34.75 U1.10 62.48,34.03 62.48,32.38 | U1.34 64.62,30.48 63.5,30.48 | U1.1 65.53,31.24 64.12,31.24 | U1.3 64.12,31.24 | 64.12,31.24 63.75,31.24
  Top 0.508: v14.99,74.3 14.99,74.29 C1.1 17.14,73.53 U2.2 | C2.1 v9.65,66.29 | C6.1 v9.14,61.34 | C7.1 v11.43,57.91 | C12.1 79.85,32.1 v79.88,32.13 | C18.1 79.48,26.31 v79.5,26.29
  Top 2.54: X3.1 TVS-.1
  other vias: 72.9,36.32 74.17,36.32 75.44,36.32 76.71,36.32 77.98,36.32 79.25,36.32 80.52,36.32 81.79,36.32 83.06,36.32 84.33,36.32 85.6,36.32 86.87,36.32 73.53,35.05 74.8,35.05 76.07,35.05 77.34,35.05 78.61,35.05 79.88,35.05 81.15,35.05 82.42,35.05 83.69,35.05 84.96,35.05 86.23,35.05 87.5,35.05 77.34,37.59 78.61,37.59 79.88,37.59 81.15,37.59 82.42,37.59 83.69,37.59 84.96,37.59 86.23,37.59 76.07,37.59 74.8,37.59 74.17,34.04 75.44,34.04 76.71,34.04 77.98,34.04 79.25,34.04 80.52,34.04
  pour Route2: 0,-6.35 102.87,-6.35 109.22,0 109.22,86.36 96.52,99.06 6.35,99.06 1.27,93.98 -5.08,87.63 -5.08,-3.81 -2.54,-6.35
  pour Top: 60.07,31.5 60.33,31.5 61.34,32.51
  pour Top (rank 6): 53.34,41.91 93.98,41.91 93.98,25.4 53.34,25.4
  pour Bottom (rank 2): 92.71,96.52 92.71,-7.62 -5.08,-7.62 -5.08,96.52
LINUARTRXD  (via drill 0.25 pad 0.3)
  Top 0.2: U4.3 70.46,64.36 v70.48,64.39 | v81.66,60.96 JP2.1
  Bottom 0.2: v70.48,64.39 78.23,64.39 v81.66,60.96
LINUARTTXD  (via drill 0.25 pad 0.3)
  Top 0.2: U4.2 71.11,63.73 v71.12,63.75 | v81.79,58.42 JP2.2
  Bottom 0.2: v81.79,58.42 81.79,59.94 77.98,63.75 v71.12,63.75
N$1  (via drill 0.25 pad 0.3)
  Top 0.2: R11.1 v76.71,57.66 | U3.3 32.08,26.54 v33.27,26.54
  Bottom 0.254: v33.27,26.54 33.25,26.57 32.99,26.95 32.99,34.98 29.29,38.68 29.29,51.41 38.46,60.58 58.04,60.58 60.96,63.5 64.26,63.5 68.58,59.18 76.33,59.18 76.71,58.8 v76.71,57.66
N$2
  Top 0.254: U1.32 66.52,27.16 C13.1
N$3  (via drill 0.25 pad 0.3)
  Top 0.2: R4.2 v75.06,49.52 v75.06,49.53 R6.1 | v75.06,47.37 R5.2
  Bottom 0.2: v75.06,49.53 v75.06,47.37
N$4  (via drill 0.25 pad 0.3)
  Top 0.2: Q9.2 60.77,50.87 v60.71,50.93 | v60.71,54.99 R7.1 | v60.71,57.02 R8.1
  Bottom 0.2: v60.71,50.93 v60.71,54.99 v60.71,57.02
N$5  (via drill 0.25 pad 0.3)
  Top 0.2: R4.1 75.19,51.06 v75.18,51.05 | v74.8,52.58 74.77,52.62 L2.2
  Bottom 0.2: v75.18,51.05 74.8,51.44 v74.8,52.58
N$7  (via drill 0.25 pad 0.3)
  Top 0.2: Q10.2 79.49,44.05 | 79.49,44.05 v79.5,44.07 | v79.5,45.97 R10.1 | R9.1 80.88,44.05 79.49,44.05
  Bottom 0.2: v79.5,44.07 v79.5,45.97
N$8
  Top 0.254: U1.31 66.18,26.8 C13.2
N$10
  Top 0.254: Q3.4 46.08,20.49 R31.2 46,21.67 R30.2
N$11
  Top 0.305: R21.2 63.5,20.64 Q1.4 65.15,19.13 R20.2
N$14
  Top 0.61: U2.5 27.52,73.53 Q7.1 27.55,69.46 25.31,67.22 Q8.1
N$16
  Top 0.61: C3.1 19.7,76.81 U2.1
N$17
  Top 0.254: Q6.4 31.39,33.27 R44.2 31.62,31.58 R43.2
N$18
  Top 0.254: R33.2 37.95,24.15 R34.2 37.95,18.87 Q4.4
N$19
  Top 0.254: R24.2 56.26,20.7 Q2.4
  Top 0.305: R23.2 57.02,23.83 R24.2
N$24
  Top 0.254: R40.2 31.83,20.93 R41.2 30.01,20.85 Q5.4
NRST  (via drill 0.25 pad 0.3)
  Top 0.2: JP1.4 v71.12,69.09 | v66.04,53.34 65.41,53.98 65.41,58.29 66.67,59.56 68.83,59.56 69.81,60.54 U4.4 69.81,63.16 v68.58,64.39 | v65.77,37.35 65.77,37.14 U1.9
  Bottom 0.2: v71.12,69.09 71.12,66.93 v68.58,64.39 | v66.04,53.34 66.04,51.69 68.33,49.4 68.33,40.16 65.77,37.6 v65.77,37.35
PN$6
  Top 2.54: L1.2 42.97,71.37 TVS+.1
  pour Top (rank 3): 3.81,96.52 3.81,52.07 53.34,52.07 53.34,96.52
PN$15
  Top 0.305: C22.2 63.08,12.1 D21.1 63.19,8.89 R22.1
PN$20
  Top 0.305: R25.1 C23.2 59.6,5.38 59.6,6.99 D22.1
PN$25
  Top 2.54: TVS-.2 42.93,82.59 TVS+.2
PN$28
  Top 0.305: R32.1 C32.2 44.16,10.37 D31.1
PN$29
  Top 0.254: D32.1 39.23,9.48 C33.2 R35.1
PN$33
  Top 0.254: D42.1 14.43,29.3 C43.2 R45.1
PN$34
  Top 0.254: C42.2 20.44,21 D41.1 18.3,20.61 R42.1
PWM_CMD  (via drill 0.25 pad 0.3)
  Top 0.2: v65.15,53.34 63.75,51.94 Q9.3 | v65.15,47.62 63.63,47.62 C51.2 | v77.47,51.05 79.92,51.05 TVS.1 82.72,51.14 v82.8,51.05 | v84.33,50.93 JP3.2
  Bottom 0.2: v77.47,51.05 74.09,54.43 71.31,54.43 70.67,55.07 66.88,55.07 v65.15,53.34 v65.15,47.62 | v82.8,51.05 82.93,50.93 v84.33,50.93
PWMIN  (via drill 0.25 pad 0.3)
  Top 0.2: U4.13 67.21,57.38 v66.55,58.04 | v64.64,57.02 R8.2
  Bottom 0.2: v66.55,58.04 65.66,58.04 v64.64,57.02
SA
  pour Top (rank 5): 48.64,-1.27 89.03,-1.27 89.15,-1.4 89.15,27.56 64.52,27.56 64.01,28.07 62.48,28.07 62.1,28.45 56.9,23.24 53.85,23.24 53.85,6.35 48.64,6.35
SB
  pour Top (rank 4): 45.85,-1.27 45.85,6.35 35.05,6.35 35.05,27.05 57.78,27.05 60.71,29.97 62.23,28.45 57.28,23.5 53.85,23.5 53.85,6.6 53.59,6.35 48.64,6.35 48.64,-1.27
SC
  pour Top (rank 3): 45.72,6.35 45.72,-1.27 0,-1.27 0,38.1 52.58,38.1 60.58,30.1 57.4,26.92 35.18,26.92 35.18,6.35
SPI_MISO  (via drill 0.25 pad 0.3)
  Top 0.2: U4.17 v69.81,54.61 | v66.36,37.35 66.36,37.02 U1.8
  Bottom 0.2: 66.67,37.79 66.36,37.48 v66.36,37.35
  Bottom 0.254: 66.67,37.79 68.81,39.93 68.81,49.68 66.65,51.83 66.65,53.49 67.77,54.61 v69.81,54.61
SPI_MOSI  (via drill 0.25 pad 0.3)
  Top 0.2: U4.16 69.16,53.54 v67.82,52.2 | v67.53,37.35 67.53,36.77 U1.6
  Bottom 0.2: v67.53,37.35 67.53,37.48 69.6,39.55 69.6,50.42 v67.82,52.2
SPI_NSS  (via drill 0.25 pad 0.3)
  Top 0.2: U4.14 67.86,54.02 v67.82,53.98 | v68.69,37.35 68.69,36.53 U1.4
  Bottom 0.2: v67.82,53.98 70.43,51.36 70.43,39.09 v68.69,37.35
SPI_SCK  (via drill 0.25 pad 0.3)
  Top 0.2: v67.82,53.09 68.51,53.78 U4.15 | v68.11,37.35 68.11,36.65 U1.5
  Bottom 0.2: v67.82,53.09 69.98,50.93 69.98,39.34 68.11,37.48 v68.11,37.35
SWIM  (via drill 0.25 pad 0.3)
  Top 0.2: U4.18 70.46,59.46 v70.23,59.82 | v73.66,66.8 JP1.2
  Bottom 0.2: v70.23,59.82 69.85,60.07 69.85,64.77 71.88,66.8 v73.66,66.8
TEMPSENSOR  (via drill 0.25 pad 0.3)
  Top 0.2: U4.20 v71.76,54.99 v71.75,54.99 | v73.15,57.66 R11.2
  Top 0.254: C53.2 v73.15,55.63
  Bottom 0.2: v71.75,54.99 72.52,54.99 v73.15,55.63 v73.15,57.66
VCAP
  Top 0.2: C62.1 67.21,64.73 U4.8
VCC  (via drill 0.25 pad 0.3)  (2 unrouted)
  Top 0.254: U1.35 66.19,29.62 67.08,29.62 66.99,29.53 66.47,29 65.53,29 65.11,29.42 U1.33
  Top 0.508: v79.5,29.08 79.47,29.11 C12.2 C11.2 73.26,29.09 C10.2 69.66,29.41 67.11,29.41 66.99,29.53
  other vias: 24.77,20.57 26.16,20.57 27.43,20.57 24.77,19.18 26.16,19.18 27.43,19.18 24.77,17.78 26.16,17.78 27.43,17.78 23.11,18.67 23.11,17.78 23.11,17.02 23.5,16.26 24.26,16.26 25.02,16.26 25.78,16.26 26.54,16.26 23.11,15.49 23.88,15.49 24.64,15.49 25.4,15.49 26.16,15.49 27.05,15.49 27.43,14.73 27.05,13.97 26.67,14.73 26.29,13.97 25.91,14.73 25.02,14.73 24.26,14.73 23.5,14.73 22.73,14.73 21.97,14.73 27.94,13.97 20.83,71.37 21.46,71.37 22.1,71.37 22.73,71.37 23.62,72.01 24.38,72.01 25.02,72.01 24,71.37 23.37,71.37 24.64,71.37 25.27,71.37 25.91,71.37 26.54,71.37 21.08,70.74 21.84,70.74 22.48,70.74 23.11,70.74 23.75,70.74 24.38,70.74 25.02,70.74 25.65,70.74 26.29,70.74 20.7,70.1 21.46,70.1 22.1,70.1 22.73,70.1 23.37,70.1 24,70.1 24.64,70.1 25.27,70.1 25.91,70.1 26.54,70.1 21.08,69.47 22.35,69.47 21.72,69.47 22.99,69.47 23.62,69.47 24.26,69.47 25.53,69.47 26.16,69.47 37.34,86.11 37.34,84.71 37.21,83.19 37.21,81.66 37.21,80.39 37.47,79.12 37.85,79.76 37.97,78.49 37.59,77.72 37.21,76.96 37.97,76.96 38.35,79.12 37.85,81.03 37.85,82.42 38.48,83.19 37.85,83.82 37.72,86.87 38.35,87.76 38.99,86.87 38.35,86.11 39.37,86.11 37.85,85.34 38.99,85.34 39.5,84.58 38.48,84.58 39.12,83.82 39.62,83.19 38.99,82.42 39.5,81.66 38.35,81.66 38.86,81.03 39.37,80.39 38.35,80.39 38.86,79.76 39.24,79.12 38.73,78.49 39.12,77.72 38.35,77.72 39.5,76.96 38.73,76.96 26.8,63.25 26.8,62.36 26.8,61.47 26.8,60.58 26.8,59.82 26.8,58.93 26.8,58.04 26.8,57.02 26.8,56.01 26.8,55.12 26.8,54.1 25.4,54.1 24.26,54.1 23.24,54.1 22.23,54.1 21.34,54.1 20.32,54.1 19.18,54.1 18.29,54.1 17.27,54.1 16.26,54.1 28.19,62.74 28.19,61.85 28.19,60.96 28.19,60.07 28.19,59.31 28.19,58.42 28.19,57.66 28.19,56.64 28.19,55.5 28.19,54.61 29.72,63.25 29.72,62.36 29.72,61.59 29.72,60.71 29.72,59.94 29.72,59.05 29.72,58.17 29.72,57.15 29.72,56.01 29.72,55.12 25.4,13.97 27.94,15.49 23.88,13.97 24.64,13.97 23.11,13.97 22.35,13.97 49.91,17.91 50.67,17.91 51.44,17.91 52.2,17.91 50.29,17.4 51.05,17.4 51.82,17.4 49.91,16.76 50.67,16.76 51.44,16.76 52.2,16.76 50.29,16.13 51.05,16.13 51.82,16.13 49.78,15.49 50.42,15.11 49.78,14.61 50.42,14.1 49.78,13.59 50.42,13.08 51.18,13.08 51.94,13.08 50.8,12.45 51.56,12.45 51.94,11.81 51.18,11.81 50.42,11.81 49.66,10.79 49.66,10.03 49.66,9.27 49.66,8.51 70.36,17.02 70.36,16.13 70.36,15.24 70.36,14.35 71.12,13.97 70.36,13.46 68.58,12.57 69.47,12.57 70.36,12.57 71.12,12.57 68.96,11.81 69.85,11.81 70.74,11.81 71.75,11.81 72.64,11.81 68.71,10.92 69.47,10.92 70.36,10.92 71.25,10.92 72.14,10.92 69.09,10.16 69.98,10.16 70.87,10.16 71.75,10.16 71.25,9.4 70.36,9.4 69.47,9.4 68.71,9.4 69.09,8.51 69.98,8.51 68.71,7.62 65.79,16.64 67.06,16.64 68.33,16.64 65.79,15.37 67.06,15.37 68.33,15.37 65.79,13.97 67.06,13.97 68.33,13.97 47.88,16.89 48.26,15.62 47.88,14.35 46.74,14.35 45.47,14.35 45.09,15.62 46.74,15.62 46.74,16.89 45.59,16.89
  pour Route15: -2.54,92.71 93.98,92.71 97.79,88.9 97.79,-3.81 93.98,-7.62 -2.54,-7.62
  pour Top: -0.38,64.9 -0.38,38.1 31.75,38.1 31.75,64.77 0,64.77
  pour Top: 24.77,76.2 40.13,76.2 40.13,92.2 24.77,92.2
  pour Top: 20.19,73.03 27.3,73.03 27.3,68.96 20.19,68.96
  pour Top: 17.14,19.3 23.24,19.3 23.24,22.48 28.32,22.48 28.32,13.08 17.14,13.08
  pour Top: 43.81,18.29 52.58,18.29 52.58,7.62 48.26,7.62 48.26,12.95 43.81,12.95
  pour Top: 73.53,17.78 73.53,5.97 66.55,5.97 66.55,12.45 66.67,12.57 64.14,12.57 64.14,17.78
VDD
  Top 0.406: U1.2 65.69,32.13 66.18,32.62 66.18,33.28 71.24,38.35 C15.2 71.24,40.71 C14.2
  Top 0.61: U3.5 U3.4 30.11,26.62 C52.2 22.41,26.62 19.94,29.08 19.94,33.15 24.38,37.59 27.43,37.59 29.21,39.37 29.21,51.64 38.4,60.83 51.56,60.83 58.42,53.98 58.42,53.34 58.99,52.77 Q9.1
  pour Top (rank 5): 63.5,69.85 96.52,69.85 96.52,40.51 68.58,40.51 59.82,49.28 59.82,66.17
VREG  (via drill 0.25 pad 0.3)
  Top 0.2: U1.30 64.86,27.42 v64.88,27.42 | v68.07,24.26 69.84,24.26 C16.2
  Top 0.254: C16.2 70.52,23.6 C17.2 77.09,23.6 C18.2
  Bottom 0.2: v64.88,27.42 68.04,24.26 v68.07,24.26
WDOG  (via drill 0.25 pad 0.3)
  Top 0.2: U4.10 v65.91,61.09 | v67.15,55.55 67.15,52.23 v67.18,52.2 | v66.94,37.35 66.94,36.9 U1.7
  Bottom 0.2: v65.91,61.09 67.15,59.85 v67.15,55.55 | v67.18,52.2 67.18,51.94 69.22,49.91 69.22,39.75 66.94,37.48 v66.94,37.35
(copper drawn outside any net)
  shapes: Top area x5

### Text on the board
tNames: 5in^2 | 2in^2 | Fiducial Markers | 1000 mil